# EAGLE design DC-DC (EAGLE 9.4.2)
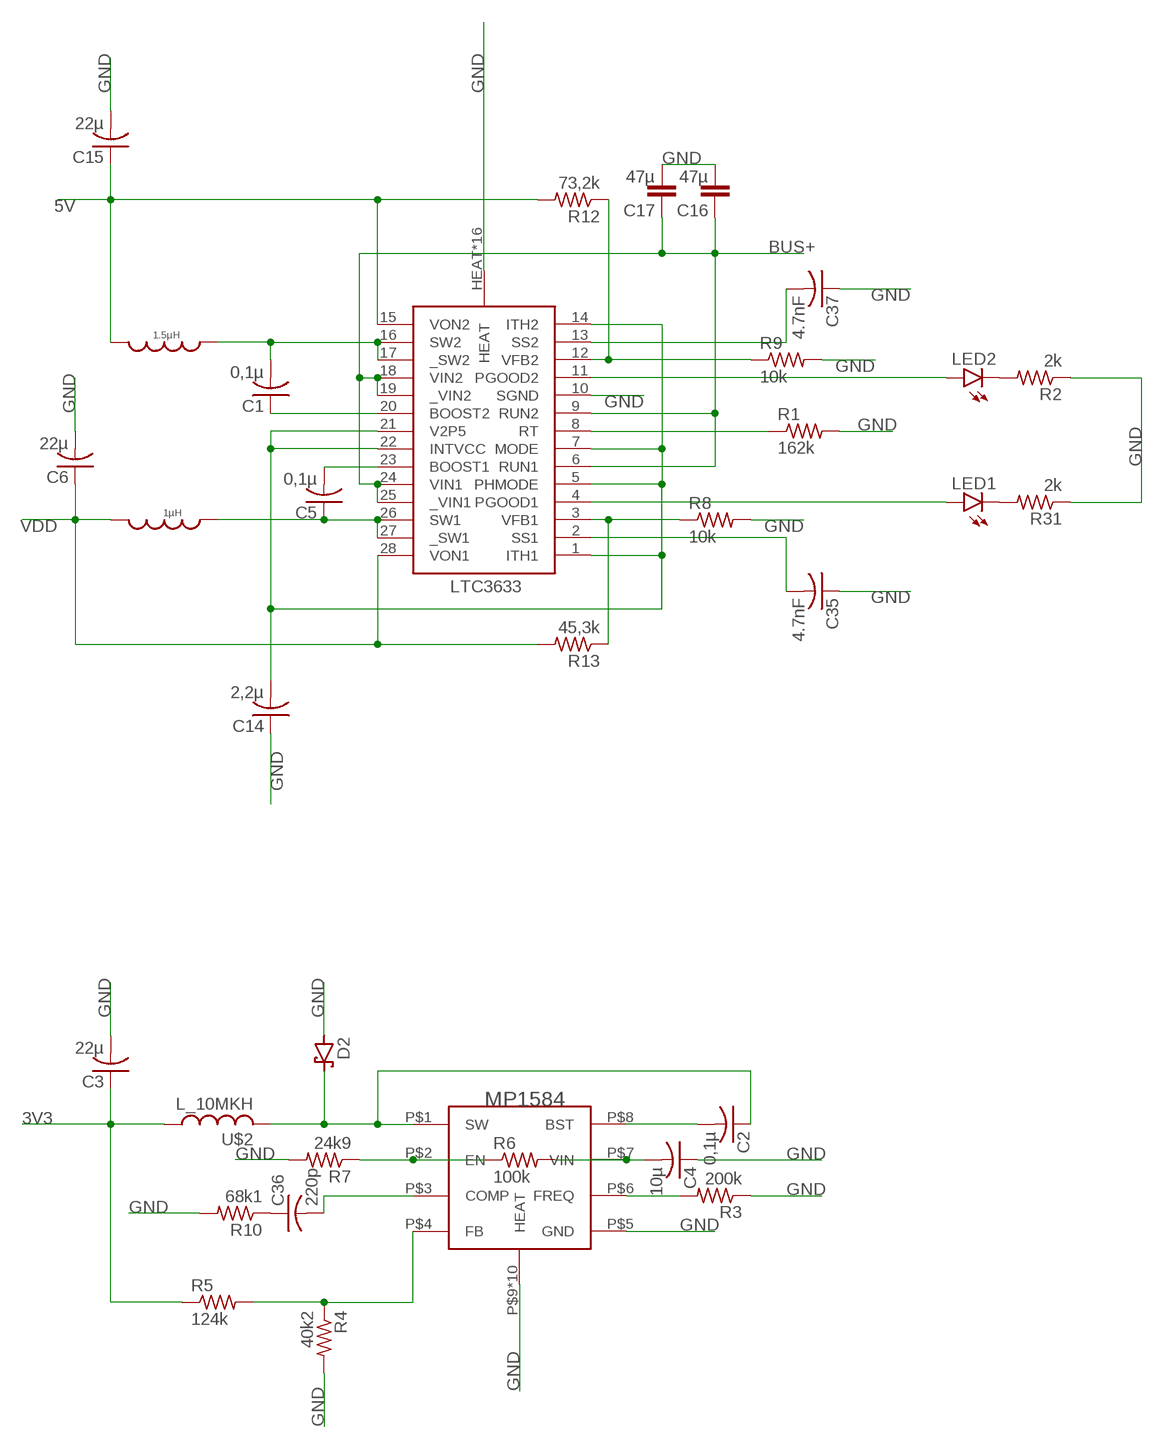
[diagram p0: schematic, sheet 1, part 1 of 3]
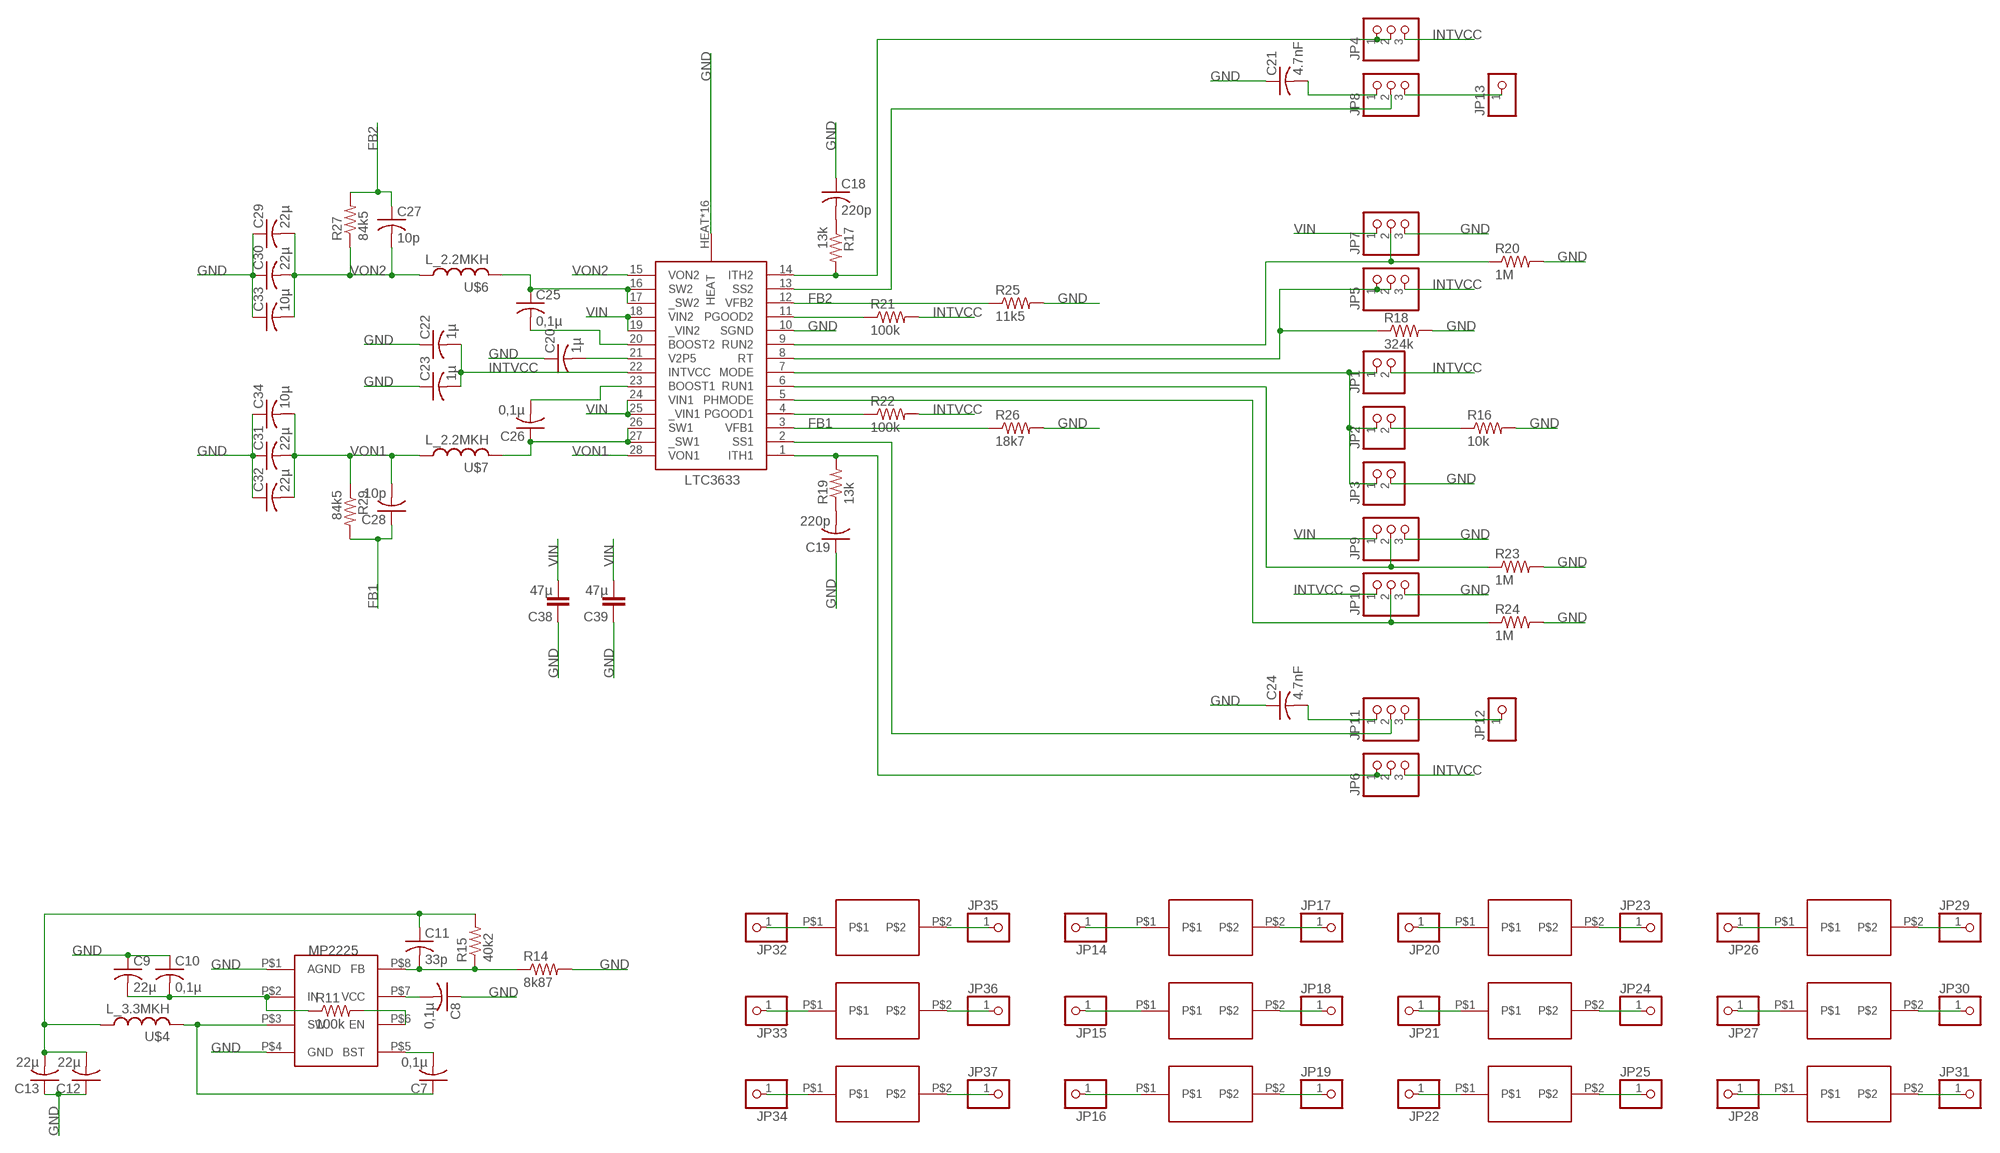
[diagram p1: schematic, sheet 1, part 2 of 3]
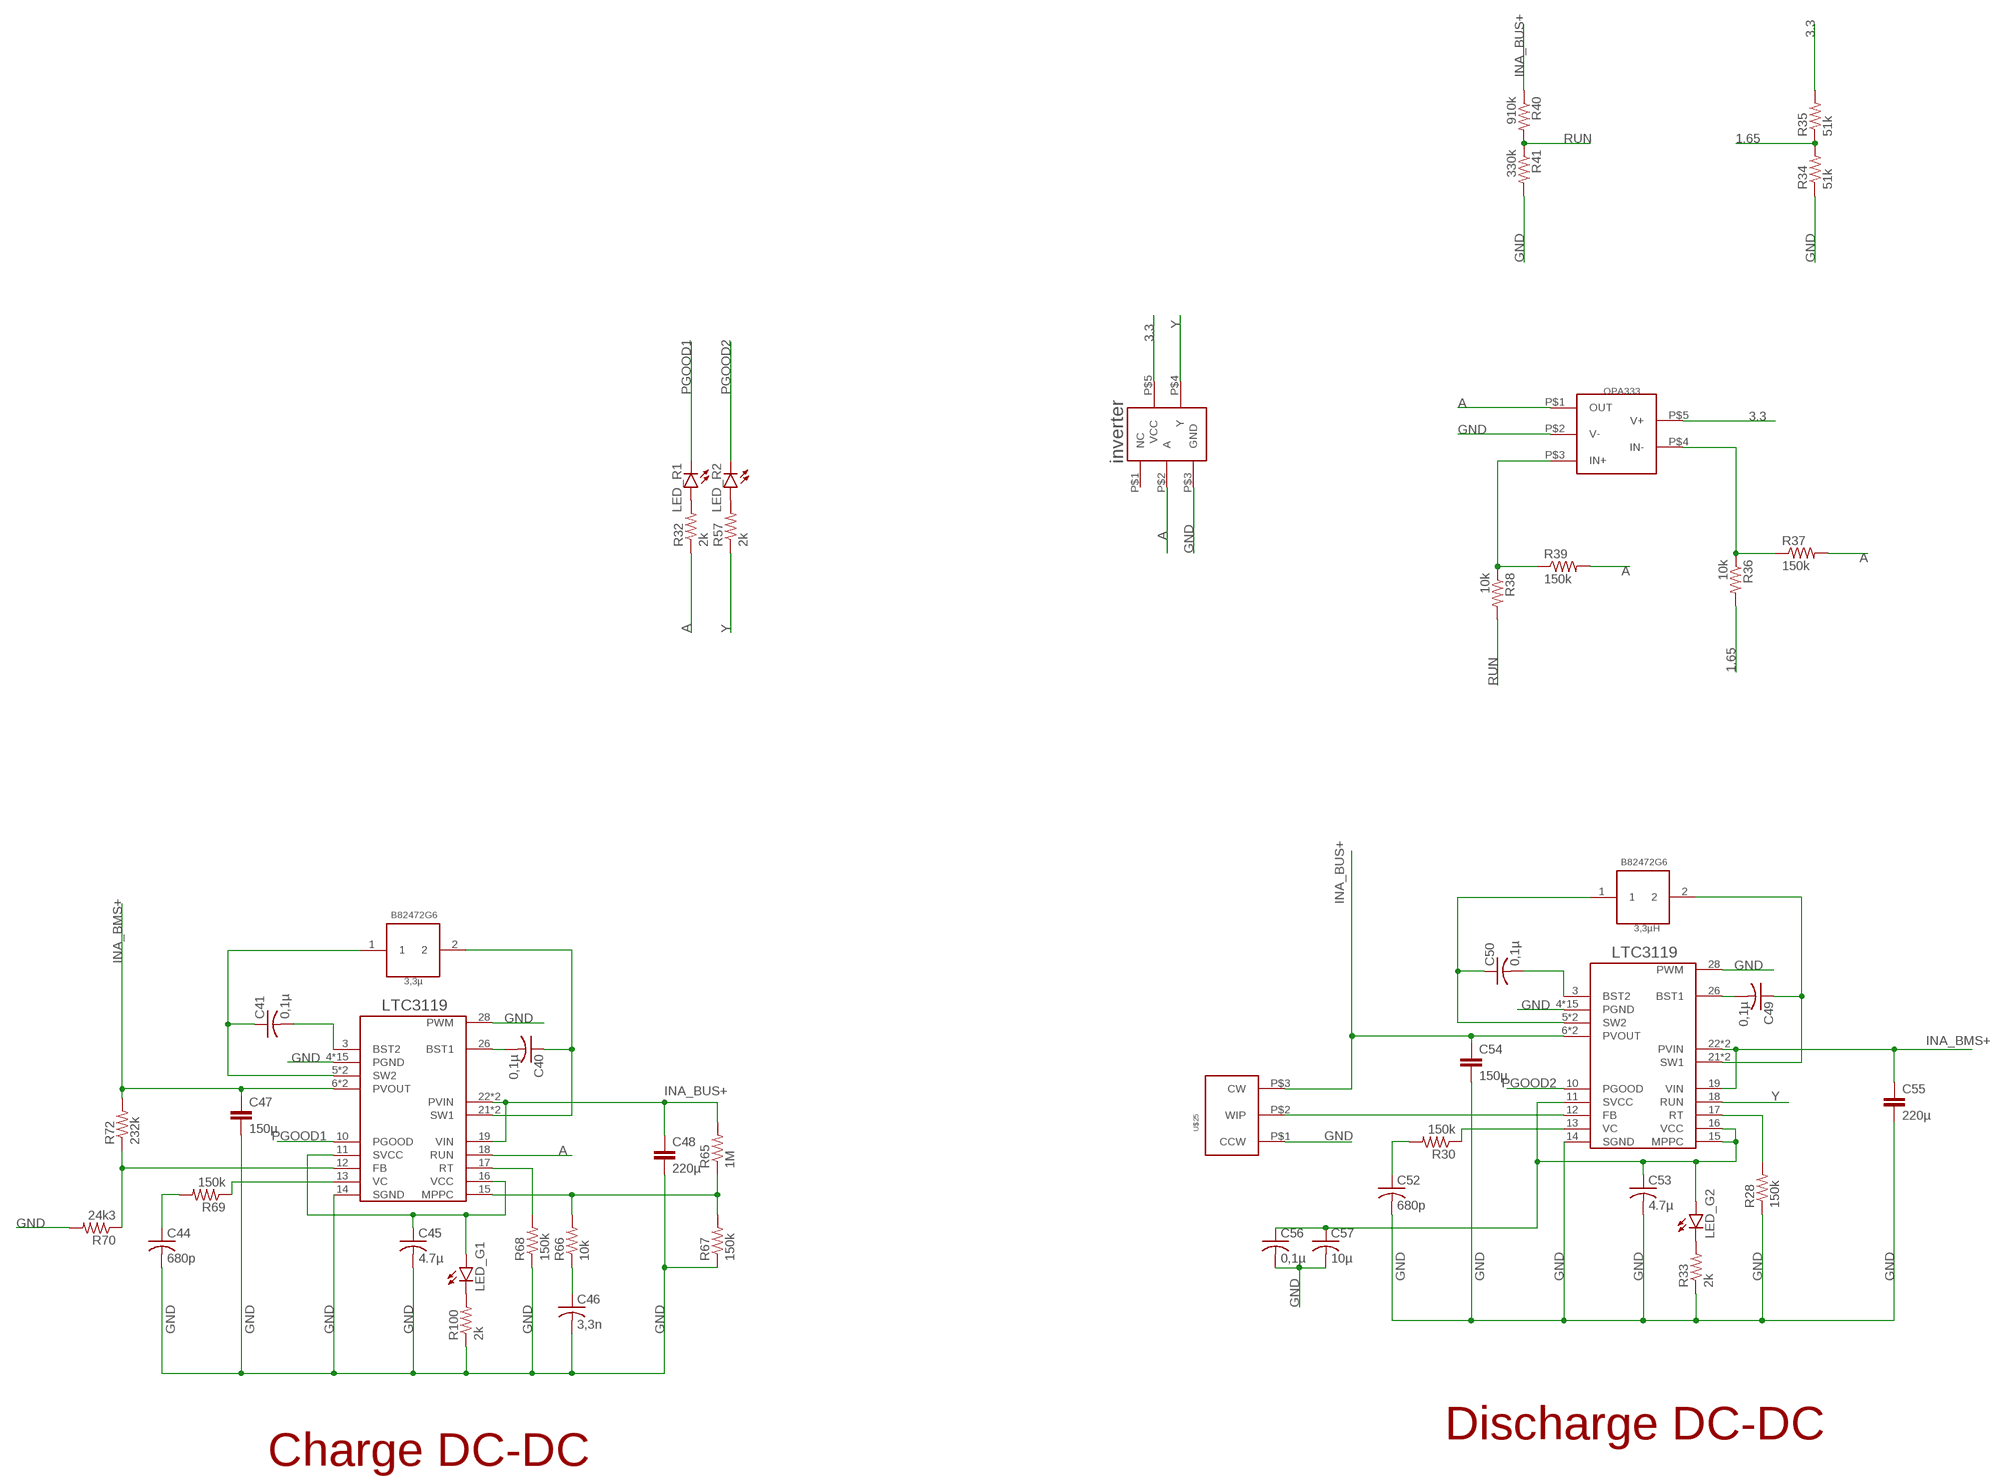
[diagram p2: schematic, sheet 1, part 3 of 3]

## Parts
3,3µH  3,3µ  B82472G6  [B82472G6]
3,3µH1  3,3µH  B82472G6  [B82472G6]
C1  0,1µ  C-USC0603  [C0603]
C2  0,1µ  C-USC0603  [C0603]
C3  22µ  C-USC1206  [C1206]
C4  10µ  C-USC1206  [C1206]
C5  0,1µ  C-USC0603  [C0603]
C6  22µ  C-USC1206  [C1206]
C7  0,1µ  C-USC0603  [C0603]
C8  0,1µ  C-USC0603  [C0603]
C9  22µ  C-USC1206  [C1206]
C10  0,1µ  C-USC0603  [C0603]
C11  33p  C-USC0603  [C0603]
C12  22µ  C-USC1206  [C1206]
C13  22µ  C-USC1206  [C1206]
C14  2,2µ  C-USC0603  [C0603]
C15  22µ  C-USC1206  [C1206]
C16  47µ  C-EUC1210  [C1210]
C17  47µ  C-EUC1210  [C1210]
C18  220p  C-USC0603  [C0603]
C19  220p  C-USC0603  [C0603]
C20  1µ  C-USC0603  [C0603]
C21  4.7nF  C-USC0603  [C0603]
C22  1µ  C-USC0603  [C0603]
C23  1µ  C-USC0603  [C0603]
C24  4.7nF  C-USC0603  [C0603]
C25  0,1µ  C-USC0603  [C0603]
C26  0,1µ  C-USC0603  [C0603]
C27  10p  C-USC0603  [C0603]
C28  10p  C-USC0603  [C0603]
C29  22µ  C-USC1206  [C1206]
C30  22µ  C-USC1206  [C1206]
C31  22µ  C-USC1206  [C1206]
C32  22µ  C-USC1206  [C1206]
C33  10µ  C-USC1206  [C1206]
C34  10µ  C-USC1206  [C1206]
C35  4.7nF  C-USC0603  [C0603]
C36  220p  C-USC0603  [C0603]
C37  4.7nF  C-USC0603  [C0603]
C38  47µ  C-EUC1210  [C1210]
C39  47µ  C-EUC1210  [C1210]
C40  0,1µ  C-USC0603  [C0603]
C41  0,1µ  C-USC0603  [C0603]
C44  680p  C-USC0603  [C0603]
C45  4.7µ  C-USC1206  [C1206]
C46  3,3n  C-USC0603  [C0603]
C47  150µ  ECAPECAP150  [ECAP150]
C48  220µ  ECAPECAP220  [ECAP220]
C49  0,1µ  C-USC0603  [C0603]
C50  0,1µ  C-USC0603  [C0603]
C52  680p  C-USC0603  [C0603]
C53  4.7µ  C-USC1206  [C1206]
C54  150µ  ECAPECAP150  [ECAP150]
C55  220µ  ECAPECAP220  [ECAP220]
C56  0,1µ  C-USC0603  [C0603]
C57  10µ  C-USC1206  [C1206]
D2  SCHOTTKY-DIODESMC  [SMC]
INVERT  INVERTER  [SOT23-5]
JP1  PINHD-1X2  [1X02]
JP2  PINHD-1X2  [1X02]
JP3  PINHD-1X2  [1X02]
JP4  PINHD-1X3  [1X03]
JP5  PINHD-1X3  [1X03]
JP6  PINHD-1X3  [1X03]
JP7  PINHD-1X3  [1X03]
JP8  PINHD-1X3  [1X03]
JP9  PINHD-1X3  [1X03]
JP10  PINHD-1X3  [1X03]
JP11  PINHD-1X3  [1X03]
JP12  PINHD-1X1  [1X01]
JP13  PINHD-1X1  [1X01]
JP14  PINHD-1X1  [1X01]
JP15  PINHD-1X1  [1X01]
JP16  PINHD-1X1  [1X01]
JP17  PINHD-1X1  [1X01]
JP18  PINHD-1X1  [1X01]
JP19  PINHD-1X1  [1X01]
JP20  PINHD-1X1  [1X01]
JP21  PINHD-1X1  [1X01]
JP22  PINHD-1X1  [1X01]
JP23  PINHD-1X1  [1X01]
JP24  PINHD-1X1  [1X01]
JP25  PINHD-1X1  [1X01]
JP26  PINHD-1X1  [1X01]
JP27  PINHD-1X1  [1X01]
JP28  PINHD-1X1  [1X01]
JP29  PINHD-1X1  [1X01]
JP30  PINHD-1X1  [1X01]
JP31  PINHD-1X1  [1X01]
JP32  PINHD-1X1  [1X01]
JP33  PINHD-1X1  [1X01]
JP34  PINHD-1X1  [1X01]
JP35  PINHD-1X1  [1X01]
JP36  PINHD-1X1  [1X01]
JP37  PINHD-1X1  [1X01]
LED1  LEDCHIPLED_0603  [CHIPLED_0603]
LED2  LEDCHIPLED_0603  [CHIPLED_0603]
LED_G1  LEDCHIPLED_0603  [CHIPLED_0603]
LED_G2  LEDCHIPLED_0603  [CHIPLED_0603]
LED_R1  LEDCHIPLED_0603  [CHIPLED_0603]
LED_R2  LEDCHIPLED_0603  [CHIPLED_0603]
OPA  OPA333  [SOT23-5]
R1  162k  R-US_R0603  [R0603]
R2  2k  R-US_R0603  [R0603]
R3  200k  R-US_R0603  [R0603]
R4  40k2  R-US_R0603  [R0603]
R5  124k  R-US_R0603  [R0603]
R6  100k  R-US_R0603  [R0603]
R7  24k9  R-US_R0603  [R0603]
R8  10k  R-US_R0603  [R0603]
R9  10k  R-US_R0603  [R0603]
R10  68k1  R-US_R0603  [R0603]
R11  100k  R-US_R0603  [R0603]
R12  73,2k  R-US_R0603  [R0603]
R13  45,3k  R-US_R0603  [R0603]
R14  8k87  R-US_R0603  [R0603]
R15  40k2  R-US_R0603  [R0603]
R16  10k  R-US_R0603  [R0603]
R17  13k  R-US_R0603  [R0603]
R18  324k  R-US_R0603  [R0603]
R19  13k  R-US_R0603  [R0603]
R20  1M  R-US_R0603  [R0603]
R21  100k  R-US_R0603  [R0603]
R22  100k  R-US_R0603  [R0603]
R23  1M  R-US_R0603  [R0603]
R24  1M  R-US_R0603  [R0603]
R25  11k5  R-US_R0603  [R0603]
R26  18k7  R-US_R0603  [R0603]
R27  84k5  R-US_R0603  [R0603]
R28  150k  R-US_R0603  [R0603]
R29  84k5  R-US_R0603  [R0603]
R30  150k  R-US_R0603  [R0603]
R31  2k  R-US_R0603  [R0603]
R32  2k  R-US_R0603  [R0603]
R33  2k  R-US_R0603  [R0603]
R34  51k  R-US_R0603  [R0603]
R35  51k  R-US_R0603  [R0603]
R36  10k  R-US_R0603  [R0603]
R37  150k  R-US_R0603  [R0603]
R38  10k  R-US_R0603  [R0603]
R39  150k  R-US_R0603  [R0603]
R40  910k  R-US_R0603  [R0603]
R41  330k  R-US_R0603  [R0603]
R57  2k  R-US_R0603  [R0603]
R65  1M  R-US_R0603  [R0603]
R66  10k  R-US_R0603  [R0603]
R67  150k  R-US_R0603  [R0603]
R68  150k  R-US_R0603  [R0603]
R69  150k  R-US_R0603  [R0603]
R70  24k3  R-US_R0603  [R0603]
R72  232k  R-US_R0603  [R0603]
R100  2k  R-US_R0603  [R0603]
U$1  MP1584+VIA  [MP1584+VIA]
U$2  L_10MKH  [L_12X12]
U$3  MP2225  [TSOT23-8]
U$4  L_3.3MKH  L_3.3MKH_5X5  [L_SPM5020]
U$5  LTC3633+VIA  [LTC3633+VIA]
U$6  L_2.2MKH  [L_SPM4020]
U$7  L_2.2MKH  [L_SPM4020]
U$8  GRAFITGRAFIT1  [GRAFIT1]
U$9  GRAFITGRAFIT1_1  [GRAFIT1_1]
U$10  LTC3633+VIA  [LTC3633+VIA]
U$11  1µH  VLS3012HBX  [VLS3012HBX]
U$12  SPM4020  [SPM4020]
U$13  GRAFITGRAFIT1_2  [GRAFIT1_2]
U$14  GRAFITGRAFIT2  [GRAFIT2]
U$15  GRAFITGRAFIT2_1  [GRAFIT2_1]
U$16  GRAFITGRAFIT2_2  [GRAFIT2_2]
U$17  GRAFITGRAFIT3  [GRAFIT3]
U$18  GRAFITGRAFIT3_1  [GRAFIT3_1]
U$19  GRAFITGRAFIT3_2  [GRAFIT3_2]
U$20  GRAFITGRAFIT4  [GRAFIT4]
U$21  GRAFITGRAFIT4_1  [GRAFIT4_1]
U$22  GRAFITGRAFIT4_2  [GRAFIT4_2]
U$23  LTC31191  [LTC3119+VIA]
U$25  32961  [3296W]
U$59  LTC31191  [LTC3119+VIA]

## Nets
1.65: R34.2 R35.1 R36.2
3.3: INVERT.P$5(VCC) OPA.P$5(V+) R35.2
3V3: C3.1 R5.1 U$2.P$1
5V: C15.1 R12.2 U$10.15(VON2) U$12.P$2
90: R65.1 R66.2 R67.2 U$59.15(MPPC)
A: INVERT.P$2(A) OPA.P$1(OUT) R32.1 R37.2 R39.2 U$59.18(RUN)
BUS+: C16.1 C17.1 U$10.6(RUN1) U$10.9(RUN2) U$10.18(VIN2) U$10.19(_VIN2) U$10.24(VIN1) U$10.25(_VIN1)
FB1: C28.1 R26.1 R29.2 U$5.3(VFB1)
FB2: C27.1 R25.1 R27.2 U$5.12(VFB2)
GND: C3.2 C4.1 C6.2 C8.1 C9.1 C10.1 C12.1 C13.1 C14.1 C15.2 C16.2 C17.2 C18.1 C19.1 C20.1 C21.1 C22.1 C23.1 C24.1 C29.1 C30.1 C31.1 C32.1 C33.1 C34.1 C35.1 C37.1 C38.1 C39.1 C44.2 C45.2 C46.2 C47.P$2 C48.P$2 C52.2 C53.2 C54.P$2 C55.P$2 C56.2 C57.2 D2.A INVERT.P$3(GND) JP3.2 JP7.3 JP9.3 JP10.3 OPA.P$2(V-) R1.2 R2.1 R3.1 R4.2 R7.2 R8.2 R9.2 R10.2 R14.2 R16.2 R18.2 R20.2 R23.2 R24.2 R25.2 R26.2 R28.1 R31.1 R33.1 R34.1 R41.2 R67.1 R68.1 R70.2 R100.1 U$1.P$5(GND) U$1.P$9(HEAT) U$1.P$10(HEAT) U$1.P$11(HEAT) U$1.P$12(HEAT) U$1.P$13(HEAT) U$1.P$14(HEAT) U$1.P$15(HEAT) U$1.P$16(HEAT) U$1.P$17(HEAT) U$1.P$18(HEAT) U$3.P$1(AGND) U$3.P$4(GND) U$5.10(SGND) U$5.HEAT U$5.P$1(HEAT) U$5.P$2(HEAT) U$5.P$3(HEAT) U$5.P$4(HEAT) U$5.P$5(HEAT) U$5.P$6(HEAT) U$5.P$7(HEAT) U$5.P$8(HEAT) U$5.P$9(HEAT) U$5.P$10(HEAT) U$5.P$11(HEAT) U$5.P$12(HEAT) U$5.P$13(HEAT) U$5.P$14(HEAT) U$5.P$15(HEAT) U$10.10(SGND) U$10.HEAT U$10.P$1(HEAT) U$10.P$2(HEAT) U$10.P$3(HEAT) U$10.P$4(HEAT) U$10.P$5(HEAT) U$10.P$6(HEAT) U$10.P$7(HEAT) U$10.P$8(HEAT) U$10.P$9(HEAT) U$10.P$10(HEAT) U$10.P$11(HEAT) U$10.P$12(HEAT) U$10.P$13(HEAT) U$10.P$14(HEAT) U$10.P$15(HEAT) U$23.4(PGND) U$23.9(PGND) U$23.14(SGND) U$23.20(PGND) U$23.25(PGND) U$23.28(PWM) U$23.29(PGND) U$23.P$1(PGND) U$23.P$2(PGND) U$23.P$3(PGND) U$23.P$4(PGND) U$23.P$5(PGND) U$23.P$6(PGND) U$23.P$7(PGND) U$23.P$8(PGND) U$23.P$9(PGND) U$23.P$10(PGND) U$25.P$1(CCW) U$59.4(PGND) U$59.9(PGND) U$59.14(SGND) U$59.20(PGND) U$59.25(PGND) U$59.28(PWM) U$59.29(PGND) U$59.P$1(PGND) U$59.P$2(PGND) U$59.P$3(PGND) U$59.P$4(PGND) U$59.P$5(PGND) U$59.P$6(PGND) U$59.P$7(PGND) U$59.P$8(PGND) U$59.P$9(PGND) U$59.P$10(PGND)
INA_BMS+: C47.P$1 C55.P$1 R72.2 U$23.19(VIN) U$23.22(PVIN) U$23.23(PVIN) U$59.6(PVOUT) U$59.7(PVOUT)
INA_BUS+: C48.P$1 C54.P$1 R40.1 R65.2 U$23.6(PVOUT) U$23.7(PVOUT) U$25.P$3(CW) U$59.19(VIN) U$59.22(PVIN) U$59.23(PVIN)
INTVCC: C22.2 C23.2 JP1.2 JP4.3 JP5.3 JP6.3 JP10.1 R21.2 R22.2 U$5.22(INTVCC)
N$1: R1.1 U$10.8(RT)
N$2: LED1.C R31.2
N$3: LED2.A U$10.11(PGOOD2)
N$4: LED2.C R2.2
N$5: C2.2 U$1.P$8(BST)
N$6: C2.1 D2.C U$1.P$1(SW) U$2.P$2
N$7: R3.2 U$1.P$6(FREQ)
N$8: R4.1 R5.2 U$1.P$4(FB)
N$9: R6.1 R7.1 U$1.P$2(EN)
N$10: C4.2 R6.2 U$1.P$7(VIN)
N$11: C36.1 R10.1
N$12: C36.2 U$1.P$3(COMP)
N$13: C7.2 U$3.P$5(BST)
N$14: C7.1 U$3.P$3(SW) U$4.P$2
N$15: R11.2 U$3.P$6(EN)
N$16: C8.2 U$3.P$7(VCC)
N$17: C9.2 C10.2 R11.1 U$3.P$2(IN)
N$18: C11.2 R14.1 R15.1 U$3.P$8(FB)
N$19: C11.1 C12.2 C13.2 R15.2 U$4.P$1
N$20: JP1.1 JP2.1 JP3.1 U$5.7(MODE)
N$21: JP4.1 JP4.2 R17.2 U$5.14(ITH2)
N$22: C18.2 R17.1
N$23: JP2.2 R16.1
N$24: C14.2 U$10.1(ITH1) U$10.5(PHMODE) U$10.7(MODE) U$10.14(ITH2) U$10.21(V2P5) U$10.22(INTVCC)
N$25: R8.1 R13.1 U$10.3(VFB1)
N$26: JP5.1 JP5.2 R18.1 U$5.8(RT)
N$27: C20.2 U$5.21(V2P5)
N$28: C5.1 U$10.26(SW1) U$10.27(_SW1) U$11.P$1
N$29: JP6.1 JP6.2 R19.2 U$5.1(ITH1)
N$30: C19.2 R19.1
N$31: C5.2 U$10.23(BOOST1)
N$32: C1.1 U$10.20(BOOST2)
N$33: C1.2 U$10.16(SW2) U$10.17(_SW2) U$12.P$1
N$34: C25.1 U$5.16(SW2) U$5.17(_SW2) U$6.P$2
N$35: C26.1 U$5.26(SW1) U$5.27(_SW1) U$7.P$2
N$36: R22.1 U$5.4(PGOOD1)
N$37: JP8.2 U$5.13(SS2)
N$38: JP7.2 R20.1 U$5.9(RUN2)
N$39: R9.1 R12.1 U$10.12(VFB2)
N$40: R21.1 U$5.11(PGOOD2)
N$41: JP9.2 R23.1 U$5.6(RUN1)
N$42: JP11.2 U$5.2(SS1)
N$43: C21.2 JP8.1
N$44: JP10.2 R24.1 U$5.5(PHMODE)
N$45: C24.2 JP11.1
N$46: C25.2 U$5.20(BOOST2)
N$47: LED1.A U$10.4(PGOOD1)
N$48: C26.2 U$5.23(BOOST1)
N$49: JP8.3 JP13.1
N$50: JP11.3 JP12.1
N$51: C35.2 U$10.2(SS1)
N$52: C37.2 U$10.13(SS2)
N$53: JP14.1 U$14.P$1
N$54: JP15.1 U$15.P$1
N$55: JP16.1 U$16.P$1
N$56: JP17.1 U$14.P$2
N$57: JP18.1 U$15.P$2
N$58: JP19.1 U$16.P$2
N$59: JP20.1 U$17.P$1
N$60: JP21.1 U$18.P$1
N$61: JP22.1 U$19.P$1
N$62: JP23.1 U$17.P$2
N$63: JP24.1 U$18.P$2
N$64: JP25.1 U$19.P$2
N$65: JP26.1 U$20.P$1
N$66: JP27.1 U$21.P$1
N$67: JP28.1 U$22.P$1
N$68: JP29.1 U$20.P$2
N$69: JP30.1 U$21.P$2
N$70: JP31.1 U$22.P$2
N$71: JP32.1 U$8.P$1
N$72: JP33.1 U$9.P$1
N$73: JP34.1 U$13.P$1
N$74: JP35.1 U$8.P$2
N$75: JP36.1 U$9.P$2
N$76: JP37.1 U$13.P$2
N$77: 3,3µH1.2 C49.1 U$23.21(SW1) U$23.24(SW1)
N$78: 3,3µH1.1 C50.1 U$23.5(SW2) U$23.8(SW2)
N$79: R28.2 U$23.17(RT)
N$80: C49.2 U$23.26(BST1)
N$81: R30.1 U$23.13(VC)
N$82: C52.1 R30.2
N$84: C50.2 U$23.3(BST2)
N$85: LED_R1.A R32.2
N$86: U$23.12(FB) U$25.P$2(WIP)
N$87: LED_R2.A R57.2
N$89: R70.1 R72.1 U$59.12(FB)
N$90: OPA.P$3(IN+) R38.1 R39.1
N$91: LED_G1.C R100.2
N$92: LED_G2.C R33.2
N$129: C41.2 U$59.3(BST2)
N$131: 3,3µH.2 C40.1 U$59.21(SW1) U$59.24(SW1)
N$132: 3,3µH.1 C41.1 U$59.5(SW2) U$59.8(SW2)
N$135: R69.1 U$59.13(VC)
N$136: C44.1 R69.2
N$139: C46.1 R66.1
N$142: R68.2 U$59.17(RT)
N$144: C40.2 U$59.26(BST1)
N$215: C53.1 C56.1 C57.1 LED_G2.A U$23.11(SVCC) U$23.15(MPPC) U$23.16(VCC)
N$234: C45.1 LED_G1.A U$59.11(SVCC) U$59.16(VCC)
N$302: OPA.P$4(IN-) R36.1 R37.1
PGOOD1: LED_R1.C U$59.10(PGOOD)
PGOOD2: LED_R2.C U$23.10(PGOOD)
RUN: R38.2 R40.2 R41.1
VDD: C6.1 R13.2 U$10.28(VON1) U$11.P$2
VIN: C38.2 C39.2 JP7.1 JP9.1 U$5.18(VIN2) U$5.19(_VIN2) U$5.24(VIN1) U$5.25(_VIN1)
VON1: C28.2 C31.2 C32.2 C34.2 R29.1 U$5.28(VON1) U$7.P$1
VON2: C27.2 C29.2 C30.2 C33.2 R27.1 U$5.15(VON2) U$6.P$1
Y: INVERT.P$4(Y) R57.1 U$23.18(RUN)
Unconnected: INVERT.P$1(NC)

## Notes on the sheet
- 1.5µH
- 1µH
- Discharge DC-DC
- Charge DC-DC

## Library data of the parts
3,3µH 3,3µH1 = CanCubeSat:B82472G6
C1-C15 C18-C37 C40 C41 C44-C46 C49 C50 C52 C53 C56 C57 = rcl:C-US: CAPACITOR, American symbol; SPICEPREFIX: C
C16 C17 C38 C39 = rcl:C-EU: CAPACITOR, European symbol; SPICEPREFIX: C
C47 C48 C54 C55 = CanCubeSat:ECAP
D2 = diode:SCHOTTKY-DIODE: Schottky Diode
INVERT = CanCubeSat:INVERTER
JP1-JP3 = pinheadCS:PINHD-1X2: PIN HEADER
JP4-JP11 = pinheadCS:PINHD-1X3: PIN HEADER
JP12-JP37 = pinheadCS:PINHD-1X1: PIN HEADER
LED1 LED2 LED_G1 LED_G2 LED_R1 LED_R2 = led:LED: LED OSRAM: - CHIPLED LG R971, LG N971, LY N971, LG Q971, LY Q971, LO R971, LY R971 LH N974, LH R974 LS Q976, LO Q976, LY Q976 LO Q996 - Hyper CHIPLED LW Q18S LB Q993, LB Q99A, LB R99A - SideLED LS A670, LO A670, LY A670, LG A670, LP A670 LB A673, LV A673, LT A673, LW A673 LH A674 LY A675 LS A676, LA A676, LO A676, LY A676, LW A676 LS A679, LY A679, LG A679 - Hyper Micro SIDELED® LS Y876, LA Y876, LO Y876, LY Y876 LT Y87S - SmartLED LW L88C, LW L88S LB L89C, LB L89S, LG L890 LS L89K, LO L89K, LY L89K LS L896, LA L896, LO L896, LY L896 - TOPLED LS T670, LO T670, LY T670, LG T670, LP T670 LSG T670, LSP T670, LSY T670, LOP T670, LYG T670 LG T671, LOG T671, LSG T671 LB T673, LV T673, LT T673, LW T673 LH T674 LS T676, LA T676, LO T676, LY T676, LB T676, LH T676, LSB T676, LW T676 LB T67C, LV T67C, LT T67C, LS T67K, LO T67K, LY T67K, LW E67C LS E67B, LA E67B, LO E67B, LY E67B, LB E67C, LV E67C, LT E67C LW T67C LS T679, LY T679, LG T679 LS T770, LO T770, LY T770, LG T770, LP T770 LB T773, LV T773, LT T773, LW T773 LH T774 LS E675, LA E675, LY E675, LS T675 LS T776, LA T776, LO T776, LY T776, LB T776 LHGB T686 LT T68C, LB T68C - Hyper Mini TOPLED® LB M676 - Mini TOPLED Santana® LG M470 LS M47K, LO M47K, LY M47K Source: http://www.osram.convergy.de LUXEON: - LUMILED® LXK2-PW12-R00, LXK2-PW12-S00, LXK2-PW14-U00, LXK2-PW14-V00 LXK2-PM12-R00, LXK2-PM12-S00, LXK2-PM14-U00 LXK2-PE12-Q00, LXK2-PE12-R00, LXK2-PE12-S00, LXK2-PE14-T00, LXK2-PE14-U00 LXK2-PB12-K00, LXK2-PB12-L00, LXK2-PB12-M00, LXK2-PB14-N00, LXK2-PB14-P00, LXK2-PB14-Q00 LXK2-PR12-L00, LXK2-PR12-M00, LXK2-PR14-Q00, LXK2-PR14-R00 LXK2-PD12-Q00, LXK2-PD12-R00, LXK2-PD12-S00 LXK2-PH12-R00, LXK2-PH12-S00 LXK2-PL12-P00, LXK2-PL12-Q00, LXK2-PL12-R00 Source: www.luxeon.com KINGBRIGHT: KA-3528ASYC Source: www.kingbright.com
OPA = CanCubeSat:OPA333
R1-R41 R57 R65-R70 R72 R100 = resistor:R-US_: RESISTOR, American symbol
U$1 = CanCubeSat:MP1584+VIA
U$2 = CanCubeSat:L_10MKH
U$3 = CanCubeSat:MP2225
U$4 = CanCubeSat:L_3.3MKH_5X5
U$5 U$10 = CanCubeSat:LTC3633+VIA
U$6 U$7 = CanCubeSat:L_2.2MKH
U$8 U$9 U$13-U$22 = CanCubeSat:GRAFIT
U$11 = CanCubeSat:VLS3012HBX
U$12 = CanCubeSat:SPM4020
U$23 U$59 = CanCubeSat:LTC3119
U$25 = CanCubeSat:3296

## Board
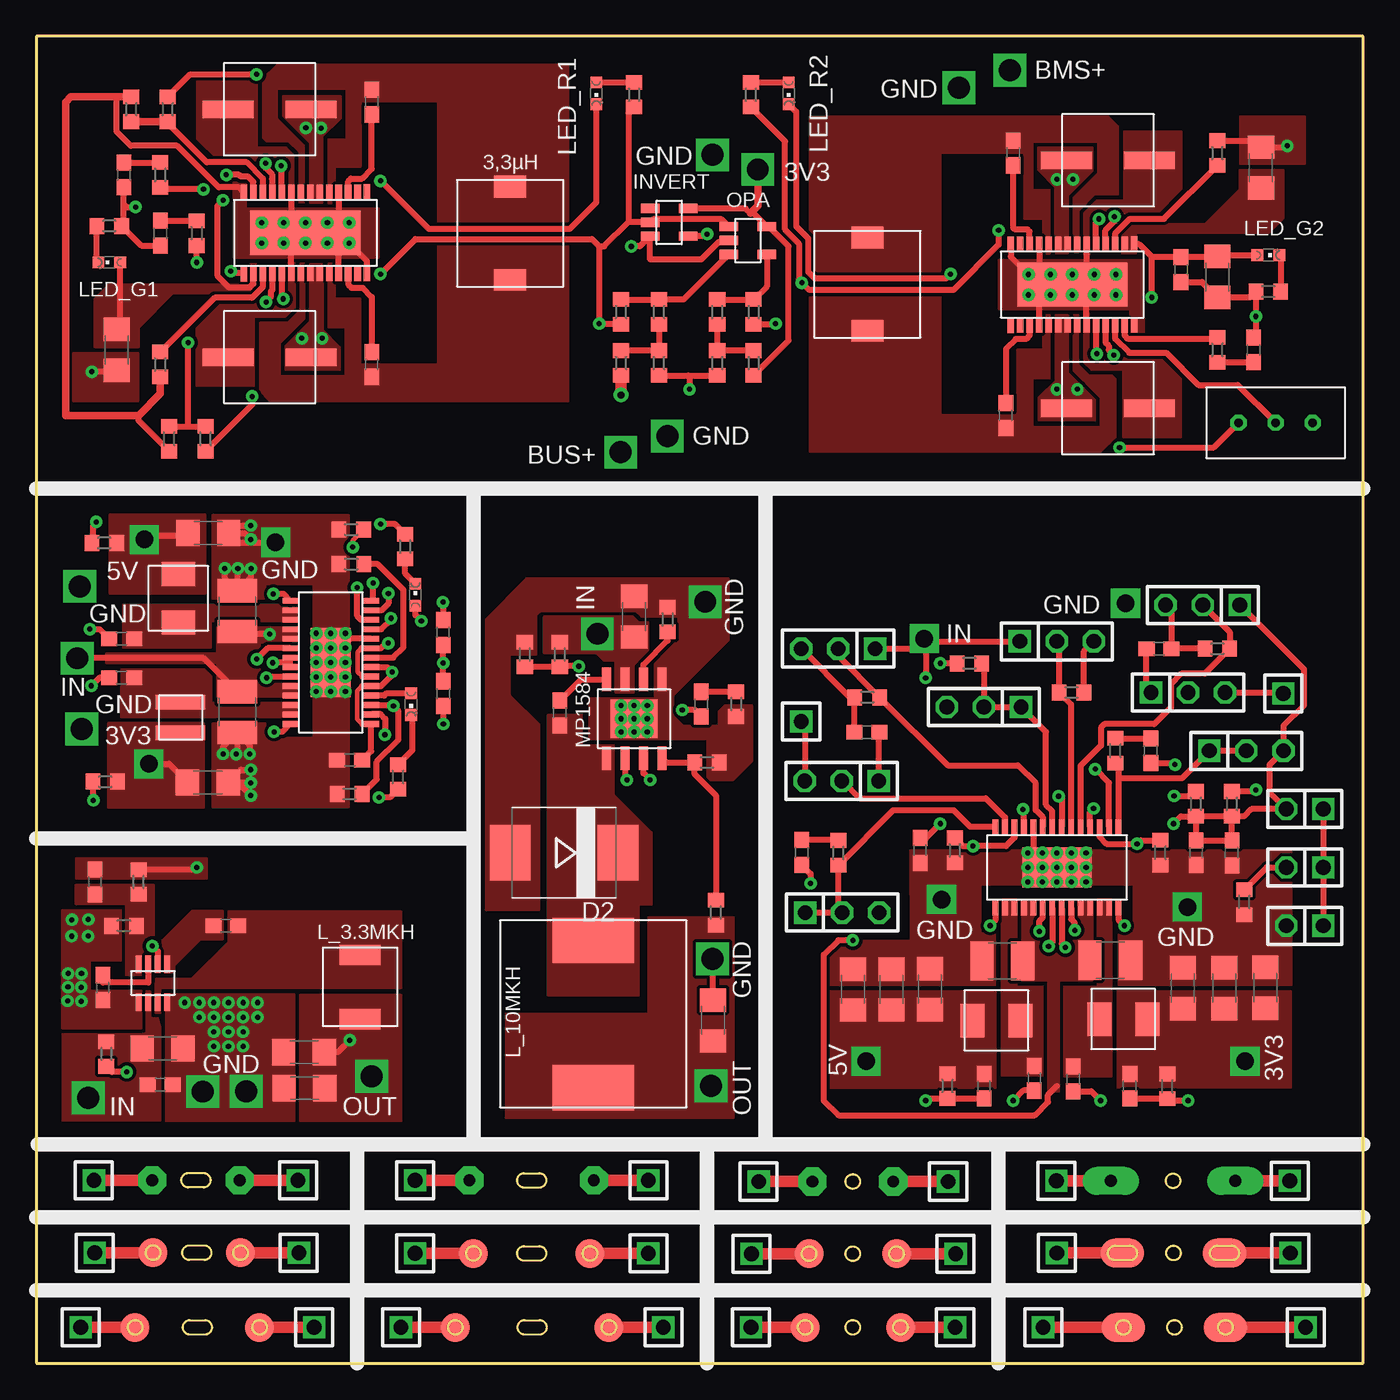
[diagram p3: board, top side]
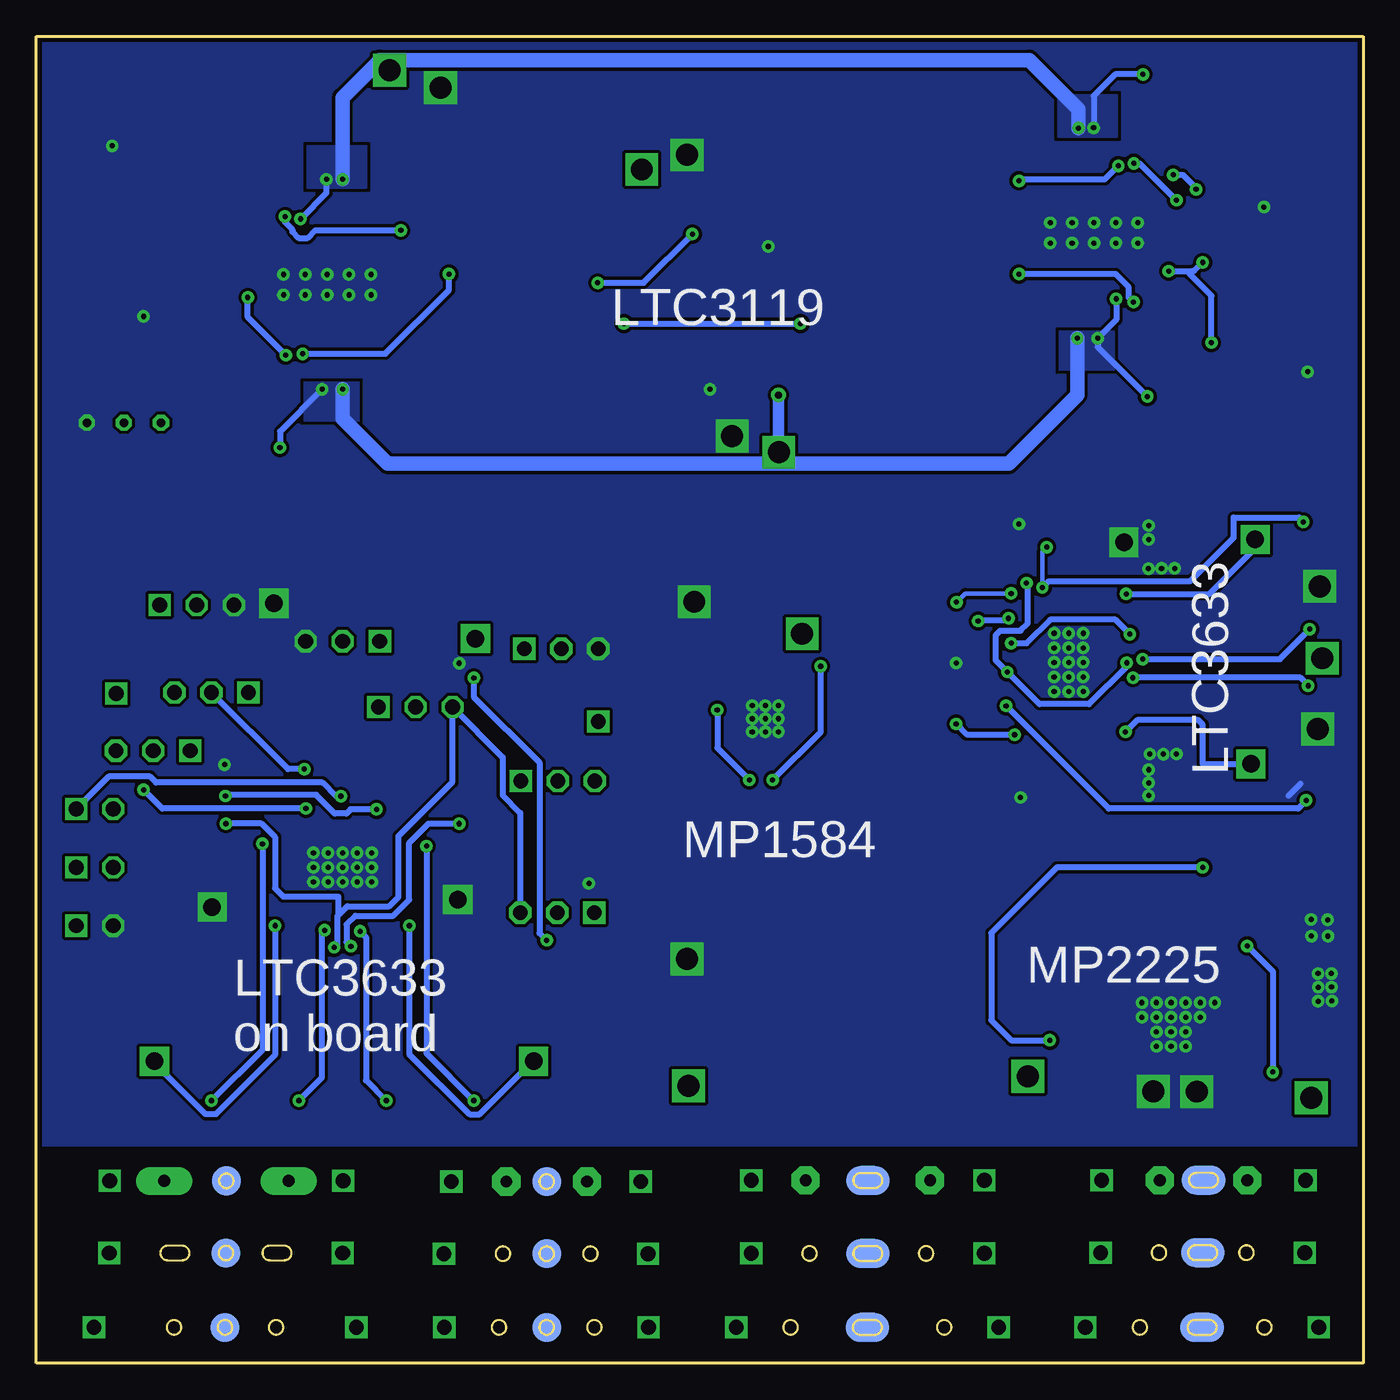
[diagram p4: board, bottom side, seen from below]

Size 91 x 91 mm. Coordinates in mm from the lower left corner, seen from the top.
Outline: 0,0 91,0 91,91 0,91 0,0
Copper layers (1*16): Top 0.035mm / dielectric 1.5mm / Bottom 0.035mm
Design rules "default *": minimum track width 0.3mm, minimum drill 0.35mm, track to track 0.22mm, track to pad 0.22mm, pad to pad 0.2mm, via to via 0.22mm, smd to smd 0.22mm, copper to edge 0.3mm, drill to drill 0.3mm, minimum pad ring 0.25mm, minimum via ring 0.25mm, stop-mask expansion 4mil, vias tented up to drill 0mil, thermal gap 10mil

### Footprints (pad centres in the part's own frame; a part is rotated, then mirrored left to right if it is on the bottom)
B82472G6 = smd 1.5 x 2.2: 1 -3.2,0; 2 3.2,0
C0603 = smd 1.1 x 1: 1 -0.85,0; 2 0.85,0
C1206 = smd 1.6 x 1.8: 1 -1.4,0; 2 1.4,0
C1210 = smd 1.6 x 2.7: 1 -1.4,0; 2 1.4,0
ECAP150 = smd 1.2 x 3.5: P$1 0,2.85; P$2 0,-2.85
ECAP220 = smd 1.2 x 3.5: P$1 0,2.85; P$2 0,-2.85
SMC = smd 2.8 x 3.8: A 3.7,0; C -3.7,0
SOT23-5 = smd 0.635 x 1.27: P$1 -0.95,-1.3; P$2 0,-1.3; P$3 0.95,-1.3; P$4 0.95,1.3; P$5 -0.95,1.3
1X02 = drill 1.016 square: 1 -1.27,0 | drill 1.016 octagon: 2 1.27,0
1X03 = drill 1.016 square: 1 -2.54,0 | drill 1.016 octagon: 2 0,0; 3 2.54,0
1X01 = drill 1.016 square: 1 0,0
CHIPLED_0603 = smd 0.8 x 0.8: A 0,-0.75; C 0,0.75
R0603 = smd 1 x 1.1: 1 -0.85,0; 2 0.85,0
MP1584+VIA = smd 0.61 x 1.6: P$1 -1.905,-2.7; P$2 -0.635,-2.7; P$3 0.635,-2.7; P$4 1.905,-2.7; P$5 1.905,2.7; P$6 0.635,2.7; P$7 -0.635,2.7; P$8 -1.905,2.7 | smd 3.21 x 2.62: P$9 0,0 | drill 0.35: P$10 -0.9,0.9; P$11 0,0.9; P$12 0.9,0.9; P$13 -0.9,0; P$14 0,0; P$15 0.9,0; P$16 -0.9,-0.9; P$17 0,-0.9; P$18 0.9,-0.9
L_12X12 = smd 3.1 x 5.6: P$1 -5.05,0; P$2 5.05,0
TSOT23-8 = smd 0.4 x 1.2: P$1 -0.975,-1.3; P$2 -0.325,-1.3; P$3 0.325,-1.3; P$4 0.975,-1.3; P$5 0.975,1.3; P$6 0.325,1.3; P$7 -0.325,1.3; P$8 -0.975,1.3
L_SPM5020 = smd 1.4 x 2.8: P$1 -2.2,0; P$2 2.2,0
LTC3633+VIA = smd 0.4 x 1.05: 1 -4.225,-2.775; 2 -3.575,-2.775; 3 -2.925,-2.775; 4 -2.275,-2.775; 5 -1.625,-2.775; 6 -0.975,-2.775; 7 -0.325,-2.775; 8 0.325,-2.775; 9 0.975,-2.775; 10 1.625,-2.775; 11 2.275,-2.775; 12 2.925,-2.775; 13 3.575,-2.775; 14 4.225,-2.775; 15 4.225,2.775; 16 3.575,2.775; 17 2.925,2.775; 18 2.275,2.775; 19 1.625,2.775; 20 0.975,2.775; 21 0.325,2.775; 22 -0.325,2.775; 23 -0.975,2.775; 24 -1.625,2.775; 25 -2.275,2.775; 26 -2.925,2.775; 27 -3.575,2.775; 28 -4.225,2.775 | smd 4.75 x 2.74: HEAT 0,0 | drill 0.35 pad 0.813: P$1 -2,1; P$2 -1,1; P$3 0,1; P$4 1,1; P$5 2,1; P$6 2,0; P$7 1,0; P$8 0,0; P$9 -1,0; P$10 -2,0; P$11 -2,-1; P$12 -1,-1; P$13 0,-1; P$14 1,-1; P$15 2,-1
L_SPM4020 = smd 1.65 x 2.3: P$1 -1.65,0; P$2 1.65,0
GRAFIT1 = smd 2 x 3 bottom: OUT 0,0 | drill 0.8 pad 1.93 octagon: P$1 0,-3; P$2 0,3
GRAFIT1_1 = smd 2 x 3 bottom: OUT 0,0 | smd 2 x 2: P$1 0,3; P$2 0,-3
VLS3012HBX = smd 1 x 3.4: P$1 -1.05,0; P$2 1.05,0
SPM4020 = smd 1.65 x 2.3: P$1 -1.65,0; P$2 1.65,0
GRAFIT1_2 = smd 2 x 3 bottom: OUT 0,0 | smd 2 x 2: P$1 0,4.27; P$2 0,-4.27
GRAFIT2 = smd 2 x 3 bottom: OUT 0,0 | drill 0.8 pad 1.93 octagon: P$1 0,-4.27; P$2 0,4.27
GRAFIT2_1 = smd 2 x 3 bottom: OUT 0,0 | smd 2 x 2: P$1 0,4; P$2 0,-4
GRAFIT2_2 = smd 2 x 3 bottom: OUT 0,0 | smd 2 x 2: P$1 0,5.27; P$2 0,-5.27
GRAFIT3 = smd 2 x 2 bottom: OUT 0,0 | drill 0.8 pad 1.93 octagon: P$1 0,-2.77; P$2 0,2.77
GRAFIT3_1 = smd 2 x 2 bottom: OUT 0,0 | smd 2 x 2: P$1 0,3; P$2 0,-3
GRAFIT3_2 = smd 2 x 2 bottom: OUT 0,0 | smd 2 x 2: P$1 0,3.27; P$2 0,-3.27
GRAFIT4 = smd 2 x 2 bottom: OUT 0,0 | drill 0.8 pad 1.93 long: P$1 0,-4.27; P$2 0,4.27
GRAFIT4_1 = smd 2 x 2 bottom: OUT 0,0 | smd 2 x 3: P$1 0,3.5; P$2 0,-3.5
GRAFIT4_2 = smd 2 x 2 bottom: OUT 0,0 | smd 2 x 3: P$1 0,3.5; P$2 0,-3.5
LTC3119+VIA = smd 0.45 x 1.05: 1 -4.225,-2.775; 2 -3.575,-2.775; 3 -2.925,-2.775; 4 -2.275,-2.775; 5 -1.625,-2.775; 6 -0.975,-2.775; 7 -0.325,-2.775; 8 0.325,-2.775; 9 0.975,-2.775; 10 1.625,-2.775; 11 2.275,-2.775; 12 2.925,-2.775; 13 3.575,-2.775; 14 4.225,-2.775; 15 4.225,2.775; 16 3.575,2.775; 17 2.925,2.775; 18 2.275,2.775; 19 1.625,2.775; 20 0.975,2.775; 21 0.325,2.775; 22 -0.325,2.775; 23 -0.975,2.775; 24 -1.625,2.775; 25 -2.275,2.775; 26 -2.925,2.775; 27 -3.575,2.775; 28 -4.225,2.775 | smd 7.56 x 3.05: 29 0,0 | drill 0.35 pad 0.813: P$1 -3,0.7; P$2 -1.5,0.7; P$3 0,0.7; P$4 1.5,0.7; P$5 3,0.7; P$6 3,-0.7; P$7 1.5,-0.7; P$8 0,-0.7; P$9 -1.5,-0.7; P$10 -3,-0.7
3296W = drill 0.6 octagon: P$1 -2.54,0; P$2 0,0; P$3 2.54,0

### Placement (x,y rotation side)
3,3µH  32.5,77.5 270 top
3,3µH1  57,74 90 top
C1  5.84,49.68 0 top
C2  35.9,44.6 90 top
C3  46.4,23.5 90 top
C4  41,51.2 270 top
C5  5.84,47.02 180 top
C6  11.76,39.83 0 top
C7  13,30 180 top
C8  4.55,25.76 90 top
C9  8.65,21.58 180 top
C10  8.49,19.11 180 top
C11  4,33 270 top
C12  18.36,21.33 0 top
C13  18.39,18.86 0 top
C14  21.49,41.36 0 top
C15  11.78,56.93 0 top
C16  13.78,44.65 270 top
C17  13.79,51.58 90 top
C18  52.49,35.02 90 top
C19  76.44,42 90 top
C20  60.61,35.17 90 top
C21  56.97,43.26 0 top
C22  79.54,35.01 90 top
C23  82,35 90 top
C24  77,49 180 top
C25  68.45,19.54 270 top
C26  71.11,19.49 270 top
C27  65,19 90 top
C28  75,19 90 top
C29  61.29,25.65 270 top
C30  58.65,25.63 270 top
C31  78.64,25.72 270 top
C32  81.48,25.72 270 top
C33  56.01,25.63 270 top
C34  84.3,25.75 270 top
C35  27.9,45.92 270 top
C36  45.6,45.2 270 top
C37  27.9,50.12 90 top
C38  73.66,27.64 180 top
C39  66.25,27.59 0 top
C40  23,68.5 90 top
C41  23,86.5 270 top
C44  6,81.5 270 top
C45  5.5,69.5 270 top
C46  8.5,77.5 270 top
C47  16,86 270 top
C48  16,69 270 top
C49  67,83 270 top
C50  66.5,65 90 top
C52  83.5,69.5 90 top
C53  84,82 90 top
C54  73.5,65.5 90 top
C55  73.5,82.5 90 top
C56  78.5,75 270 top
C57  81,74.5 270 top
D2  36.2,35 180 top
INVERT  43.4,78.25 270 top
JP1  87,38 180 top
JP2  87,34 180 top
JP3  87,30 180 top
JP4  55.27,30.9 0 top
JP5  65,45 180 top
JP6  83,42 0 top
JP7  55,49 180 top
JP8  55.24,39.93 180 top
JP9  69.99,49.51 0 top
JP10  80,52 180 top
JP11  79,46 0 top
JP12  85.52,45.92 270 top
JP13  52.46,44 270 top
JP14  41.97,12.53 0 top
JP15  25.97,7.52 0 top
JP16  25,2.45 0 top
JP17  25.97,12.53 0 top
JP18  41.97,7.52 0 top
JP19  43,2.45 0 top
JP20  62.54,12.45 0 top
JP21  49.05,7.5 0 top
JP22  49.02,2.45 0 top
JP23  49.54,12.45 0 top
JP24  63.05,7.5 0 top
JP25  63.02,2.45 0 top
JP26  85.97,12.5 0 top
JP27  70,7.55 0 top
JP28  69.06,2.45 0 top
JP29  69.97,12.5 0 top
JP30  86,7.55 0 top
JP31  87.06,2.45 0 top
JP32  17.94,12.54 0 top
JP33  4,7.57 0 top
JP34  3.04,2.45 0 top
JP35  3.94,12.54 0 top
JP36  18,7.57 0 top
JP37  19.04,2.45 0 top
LED1  25.7,45.2 180 top
LED2  26,52.7 0 top
LED_G1  5,75.5 90 top
LED_G2  84.5,76 270 top
LED_R1  38.4,87.1 180 top
LED_R2  51.6,87.1 180 top
OPA  48.8,77 270 top
R1  21.6,54.8 180 top
R2  25.3,56.01 270 top
R3  43.3,51 270 top
R4  46,41.2 0 top
R5  46.6,30.9 90 top
R6  35.9,48.6 90 top
R7  33.5,48.6 90 top
R8  21.49,39.04 180 top
R9  21.59,57.17 180 top
R10  48,45.2 270 top
R11  4.8,21.2 270 top
R12  4.66,56.26 0 top
R13  4.72,39.88 0 top
R14  6,30 180 top
R15  7,33 90 top
R16  82.85,31.62 270 top
R17  55,35 270 top
R18  64,48 180 top
R19  74,42 270 top
R20  56.99,45.67 180 top
R21  79.53,38.36 270 top
R22  82,38.36 270 top
R23  71,46 0 top
R24  81,49 180 top
R25  63,35.17 270 top
R26  77.09,35.01 270 top
R27  62.49,19.01 270 top
R28  81,83 270 top
R29  77.57,18.99 270 top
R30  81,69.5 270 top
R31  24.8,40.2 90 top
R32  41,87 90 top
R33  84.5,73.5 0 top
R34  46.7,68.6 90 top
R35  49.2,68.6 270 top
R36  46.7,72.1 270 top
R37  49.2,72.1 270 top
R38  42.7,72.1 270 top
R39  40.1,72.1 270 top
R40  40.1,68.6 90 top
R41  42.7,68.6 270 top
R57  49,87 90 top
R65  11.6,63.4 270 top
R66  11,77.5 270 top
R67  9.1,63.4 90 top
R68  8.5,68.5 90 top
R69  8.5,81.5 90 top
R70  6.5,86 90 top
R72  9,86 90 top
R100  5,78 180 top
U$1  41,44.2 0 top
U$2  38.2,23.95 90 top
U$3  8,26.07 0 top
U$4  22.2,25.8 90 top
U$5  70,34 180 top
U$6  65.85,23.5 0 top
U$7  74.55,23.6 180 top
U$8  10.94,12.54 90 top
U$9  11,7.57 90 top
U$10  20.19,48.06 90 top
U$11  9.89,44.28 270 top
U$12  9.73,52.46 90 top
U$13  11.04,2.45 90 top
U$14  33.97,12.53 90 top
U$15  33.97,7.52 90 top
U$16  34,2.45 90 top
U$17  56,12.45 90 top
U$18  56,7.5 90 top
U$19  56,2.45 90 top
U$20  77.97,12.5 90 top
U$21  78,7.55 90 top
U$22  78.06,2.45 90 top
U$23  71.06,73.97 0 top
U$25  85,64.5 180 top
U$59  18.45,77.53 180 top

### Tracks (layer width: path | path; a pad name or v marks a point on that pad's centre or on a via)
1.65
  Top 0.4: R35.1 R34.2 R36.2
3.3  (via drill 1.5)
  Top 0.4: 49.08,78.97 OPA.P$5 50.25,77.95 51.6,76.6 51.6,70.15 R35.2 | 48.98,78.88 48.65,79.2 INVERT.P$5
  Top 0.5: v49.48,81.88 49.48,79.38 49.08,78.97 48.98,78.88
3V3  (via drill 1.5)
  other vias: 46.28,19.02
  pour Top (no thermals): 32.2,16.8 32.2,24 42,24 42,30.6 47.8,30.6 47.8,16.8
5V  (via drill 0.35, 1.2 pad 2)
  Top 0.4: U$10.15 16.94,52.76 v16.25,52.76 | C15.1 10.22,56.77 7.67,56.77 v7.4,56.5
  Bottom 0.4: v16.25,52.76 10.54,52.76 7.4,55.9 v7.4,56.5
  pour Top (no thermals): 11.6,52.8 11.6,58.2 5,58.2 5,52.8
90  (via drill 0.35, 0.35 pad 0.7)
  Top 0.4: U$59.15 13.48,74.75 v13.33,74.9 | v11,75.5 R66.2 | R67.2 10.4,64.25 | 10.4,64.25 R65.1 | 10.4,64.25 v10.4,70
  Bottom 0.4: v13.33,74.9 11.7,74.9 | 11.7,74.9 11.6,74.9 v11,75.5 | 11.7,74.9 11.9,74.7 10.4,73.2 v10.4,70
A  (via drill 0.35)
  Top 0.4: OPA.P$1 47,78.45 42.3,78.45 INVERT.P$2 40.6,78.25 | U$59.18 16.18,73.61 16.08,73.51 16.08,73.12 v15.75,72.78 | R37.2 50.65,71.25 v50.7,71.3 | R39.2 40.05,71.3 v38.6,71.3 38.6,76.6 | v23.6,74.7 26,77.1 38.1,77.1 38.6,76.6 | R32.1 40.6,85.75 40.6,78.25 | 38.6,76.6 38.95,76.6 40.6,78.25
  Bottom 0.4: v15.75,72.78 16.07,73.11 16.07,73.8 16.97,74.7 v23.6,74.7 | v50.7,71.3 v38.6,71.3
BUS+  (via drill 0.35, 1.5)
  Top 0.3: 22.36,47.08 22.04,47.41 22.04,48.77 22.3,49.03
  Top 0.4: U$10.6 22.36,47.08 | 22.3,49.03 U$10.9 23.64,49.03 23.99,49.38 v24.13,49.38 | v16,50 13.97,50 C17.1 | C16.1 11.48,48.35 v2.8,48.35
  Bottom 0.4: v24.13,49.38 23.08,49.38 21.46,51 17,51 v16,50
  pour Top (no thermals): 18,46.8 18,45.7 12.4,45.7 12.4,48 4.8,48 4.8,48.7 12.4,48.7 12.4,50.5 18,50.5 18,49.4 15.3,49.4 15.3,46.8
FB1  (via drill 0.35)
  Top 0.4: C28.1 R29.2 77.71,18 v79,18 | U$5.3 72.91,36.11 73.41,35.62 v75.5,35.62 75.74,35.86 R26.1
  Bottom 0.4: v75.5,35.62 75.5,21.5 v79,18
FB2  (via drill 0.35)
  Top 0.4: U$5.12 67.1,36.75 67.1,36.05 66.5,35.46 v64.25,35.46 63.56,35.46 R25.1 | v61,18 61.16,18.16 R27.2 C27.1
  Bottom 0.4: v64.25,35.46 64.25,21.25 v61,18
GND  (via drill 0.35, 0.35 pad 0.7, 1.2 pad 2, 1.5)
  Top 0.4: C16.2 14.62,42.41 v14.62,41.78 | C16.2 13.78,41.77 v13.7,41.77 | C16.2 12.8,42.27 v12.8,41.78 | C17.2 12.92,53.85 v12.92,54.51 | C17.2 13.79,54.48 v13.82,54.51 | C17.2 14.72,53.91 v14.72,54.49 | C15.2 13.7,57.45 v14.7,57.45 | C15.2 14.27,56.93 v14.7,56.5 | C15.2 13.81,56.3 v16.4,56.3 | C6.2 14.03,40.7 v14.7,40.7 | C6.2 14.67,39.83 v14.7,39.8 | C6.2 13.8,39.83 v14.7,38.93 | R2.1 24.61,57.55 v23.6,57.55 | R31.1 24.25,38.8 v23.5,38.8 | C3.2 46.4,27.7 v46.38,27.72 | U$10.10 21.57,49.69 U$10.P$15 | C35.1 v27.9,48.02 C37.1 | C21.1 56.12,45.65 | 56.12,45.65 R20.2 | JP7.3 55.81,45.65 56.12,45.65 | R23.2 71.85,48.83 JP9.3 | JP10.3 77.85,51.61 C24.1 R24.2 | R18.2 v62,48 | C18.1 53.1,33.56 v53.1,32.9 | v78.1,41.05 78,41.15 C19.1 | U$5.10 68.38,35.38 U$5.P$15 | U$59.14 13.88,80.66 12.51,80.66 9.67,83.5 6.47,83.5 5.5,84.47 5.5,86.85 | C45.2 5.4,68 v3.8,68 | C53.2 84.2,83.4 | 84.2,83.4 85.7,83.4 v85.8,83.5 | U$59.4 20.73,78.95 U$59.P$10 | U$59.25 20.73,76.1 U$59.P$1 22.68,75.6 U$59.28 | U$23.25 68.78,75.4 U$23.P$1 66.83,75.9 U$23.28 | U$23.4 68.78,72.55 U$23.P$10 | C56.2 79.95,74.15 C57.2 83.25,73.1 R33.1 v83.65,71.8 83.65,70.5 C52.2 | U$23.9 72.03,72.75 U$23.P$7 | U$23.20 72.03,75.2 U$23.P$4 | OPA.P$2 47.4,76.9 46.8,76.9 45.6,75.7 42.1,75.7 INVERT.P$3 41.4,76.6 v40.8,76.6 | U$59.9 17.48,78.75 U$59.P$7 | U$59.20 17.48,76.3 U$59.P$4 | 6,79.5 6,78.15 R100.1 7.2,76.65 C46.2 | 6,79.5 C44.2 | 6,79.5 6.2,79.3 v6.8,79.3 | R67.1 7,64.65 7,65 | R41.2 44.7,67.75 | 44.7,67.75 R34.1 | 44.7,67.75 44.8,67.65 v44.8,66.8 | R28.1 83.75,83.85 84.2,83.4
  Top 0.5: R68.1 8.5,66.5 7,65 2,65 2,86.5 2.35,86.85 5.5,86.85 R70.2
  Bottom 0.4: 5.1,38.93 4.3,39.73
  other vias: 2.98,53.28 3.1,43.5 45.88,52.22 2.43,30.41 3.56,30.43 2.41,29.28 3.54,29.29 2.17,26.72 3.09,26.72 2.16,25.79 3.07,25.78 2.14,24.84 3.08,24.82 10.17,24.72 11.17,24.72 12.17,24.72 13.17,24.72 14.17,24.72 15.17,24.72 11.17,23.72 12.17,23.72 13.17,23.72 14.17,23.72 15.17,23.72 12.17,22.72 13.17,22.72 14.17,22.72 12.17,21.72 13.17,21.72 14.17,21.72 11.39,18.62 14.38,18.64 74.71,52.12 62.09,31.8 78.95,31.28 43.28,63.58 63.28,87.48 46.38,82.88
  pour Top (no thermals): 12.1,52.4 12.1,58.2 21.4,58.2 21.4,38.1 12.1,38.1 12.1,43.9 15.7,43.9 15.7,42.9 19,42.9 19,53.4 15.7,53.4 15.7,52.4
  pour Bottom (rank 2, no thermals): 0,91 0,15 91,15 91,91
  pour Top (no thermals): 41.5,51.2 44,51.2 44,49.6 42.4,48 42.4,45.6 37.9,45.6 37.9,42.8 46,42.8 46,40 47.8,40 49.1,41.3 49.1,45.1 47.2,45.1 46.8,44.7 46.8,43.7 44.4,43.7 43.7,44.4 43.7,45.8 47.5,49.6 47.5,53.8 33.6,53.8 30.8,51 30.8,31.1 34.5,31.1 34.5,43.8 32.5,45.8 32.5,48.6 34.3,48.6 34.3,51.3 34.6,51.6 41.1,51.6
  pour Top (no thermals): 8.86,25.3 8.86,16.6 17.7,16.6 17.7,25.3
  pour Top (no thermals): 7.18,25.57 7.18,22.94 1.77,22.94 1.77,31.09 5.79,31.09 5.79,27.59 3.65,27.59 3.65,25.57
  pour Top (no thermals): 65.76,25.89 53.89,25.89 54,29 60,29 59.96,35.19 86.06,35.19 86.06,25.89 74.26,25.89 74.26,29.49 75.26,29.49 75.26,32.79 64.76,32.79 64.76,29.49 65.76,29.49
  pour Top (no thermals): 17.7,75.49 17.7,72.41 17.05,71.76 14.91,71.76 14.91,67 11,67 11,71 12.79,72.79 16.79,72.79 17.28,73.28 17.28,75.49
  pour Top (no thermals): 7,69.26 2.5,69.26 2.5,66 7,66
  pour Top (no thermals): 17.63,79.5 17.63,82.87 17.13,83.37 15.15,83.37 15.15,88 11,88 11,84 12.49,82.51 16.67,82.51 17.32,81.86 17.32,79.5
  pour Top (no thermals): 14.4,79.19 14.4,81 13.5,81 13.5,75.84 23.5,75.84 23.5,79.19
  pour Top (no thermals): 71.88,76.02 71.88,78.91 72.75,79.78 74.62,79.78 74.62,84.51 78.53,84.51 78.53,80.51 76.74,78.72 72.74,78.72 72.25,78.23 72.25,76.02
  pour Top (no thermals): 82.53,82.27 87.03,82.27 87.03,85.51 82.53,85.51
  pour Top (no thermals): 71.86,72.01 71.86,68.64 72.36,68.14 74.53,68.14 74.53,63.51 78.53,63.51 78.53,67.51 77.06,68.98 72.88,68.98 72.21,69.65 72.21,72.01
  pour Top (no thermals): 75,72.31 75,70.5 76,70.5 76,75.66 66,75.66 66,72.31
INA_BMS+  (via drill 0.35, 0.35 pad 0.7, 1.5)
  Top 0.4: U$23.19 72.68,78.27 v72.89,78.48 | R72.2 10.55,88.4 v15.1,88.4
  Bottom 0.4: v72.89,78.48 71.1,80.27 v71.1,81.2 | v15.1,88.4 17,88.4 18.48,86.92 v18.48,84.73
  Bottom 1: v70,81.2 70,86.8 67.42,89.38 | 67.42,89.38 67.48,89.38 v66.78,88.68 | 67.42,89.38 22.9,89.38 19.52,86 v19.52,84.71
  pour Top (no thermals): 19.61,79.58 18.77,79.58 18.77,83.67 16.91,85.53 16.91,86.93 20.86,86.93 20.86,85.36 19.61,84.11
  pour Top (no thermals): 69.9,76.11 69.9,80.64 68.73,81.81 68.73,83.41 72.43,83.41 72.43,81.77 70.75,80.09 70.75,76.11
  pour Bottom (no thermals): 16.9,86.9 16.9,84.1 20.9,84.1 20.9,87 16.9,87
  pour Bottom (no thermals): 68.4,83.5 68.4,80.6 72.4,80.6 72.4,83.5
INA_BUS+  (via drill 0.35, 0.35 pad 0.7, 0.5, 1.5)
  Top 0.4: v74.3,62.8 80.76,62.8 U$25.P$3 | v14.8,66.3 14.8,65.75 R65.2 | U$59.19 16.83,73.1 v16.93,73
  Top 0.8: R40.1 v40.1,66.4
  Bottom 0.4: v71.4,66.8 74.3,63.9 v74.3,62.8 | v14.8,66.3 18.2,69.7 v18.2,70.3 16.93,71.57 v16.93,73
  Bottom 0.8: v40.1,66.4 40.1,62.4 40.1,61.8 40.2,61.7
  Bottom 1: v70,66.8 70,64.8 66.9,61.7 40.2,61.7 24.3,61.7 19.6,66.4 v19.6,70.3 | v40.08,62.48 40.1,62.45 40.1,62.4
  pour Top (no thermals): 19.62,75.4 19.62,70.88 20.8,69.7 20.8,68.1 17.1,68.1 17.1,69.8 18.78,71.48 18.78,75.4
  pour Top (no thermals): 69.92,71.9 70.75,71.9 70.75,67.93 72.6,66.08 72.6,64.64 68.77,64.64 68.77,66.25 69.92,67.4
  pour Bottom (no thermals): 17.1,68.1 20.8,68.1 20.8,70.8 17.1,70.8
  pour Bottom (no thermals): 68.9,64.6 72.6,64.6 72.6,67.3 68.9,67.3
INTVCC  (via drill 0.35)
  Top 0.4: U$5.22 70.33,31.21 70.33,28.75 v70.58,28.51 | v78,37 78.51,37.51 R21.2 | R21.2 C22.2 C23.2 R22.2 | R22.2 R21.2 | JP10.1 86.93,47.61 86.93,45.11 85.54,43.72 JP6.3 84.58,41.04 84.58,39.15 JP1.2 83.34,38 82.85,37.51 R22.2
  Bottom 0.4: v78,37 75.56,37 74.63,36.07 74.63,32.56 74.07,32 70.3,32 70.3,30.72 | JP4.3 57.81,37.75 59.01,38.95 59.01,41.55 JP5.3 62.46,39.86 66.17,36.15 66.17,31.96 66.8,31.34 69.68,31.34 70.3,30.72 | v70.58,28.51 70.36,28.73 70.36,30.66 70.3,30.72
N$1
  Top 0.4: U$10.8 24.47,48.38 25.18,49.1 25.18,53.03 23.41,54.8 R1.1
N$2
  Top 0.4: R31.2 25.8,42.05 25.8,44.35 LED1.C
N$3  (via drill 0.35)
  Top 0.4: U$10.11 22.97,50.34 23.66,50.34 24.32,51.01 v24.32,51.09 | v26.4,50.9 26,51.3 LED2.A
  Bottom 0.4: v24.32,51.09 24.48,50.93 26.37,50.93 v26.4,50.9
N$4
  Top 0.4: LED2.C 25.3,54.15 R2.2
N$5
  Top 0.4: C2.2 37.35,46.9 U$1.P$8
N$6
  pour Top (no thermals): 39.6,42.4 39.6,39 42.2,36.4 42.2,31.43 41.3,31.4 41.3,25.2 35.1,25.2 35.1,44.5 37.4,44.5 37.4,42.4
N$7
  Top 0.4: U$1.P$6 41.63,47.88 43.3,49.55 R3.2
N$8
  Top 0.4: R5.2 46.6,38.95 45.15,40.4 R4.1 43.2,41.2 U$1.P$4
N$9  (via drill 0.35)
  Top 0.4: U$1.P$2 40.37,40.13 v40.5,40 | v37.2,47.8 35.95,47.8 R6.1 R7.1
  Bottom 0.4: v40.5,40 37.2,43.3 v37.2,47.8
N$10  (via drill 1.5)
  other vias: 38.48,50.02
  pour Top (no thermals): 39.7,46 41,46 41,47.9 42,48.9 42,50.8 41.33,50.8 40.93,51.2 34.8,51.2 34.8,48.7 38.4,48.7 38.9,48.2 39.7,48.2
N$11
  Top 0.4: C36.1 R10.1
N$12  (via drill 0.35)
  Top 0.4: C36.2 45.15,44.8 v44.3,44.8 | v42.1,40 41.63,40.47 U$1.P$3
  Bottom 0.4: v44.3,44.8 44.3,42.2 v42.1,40
N$13
  pour Top (no thermals): 8.67,26.75 8.67,29.03 10.68,31.04 12.76,31.04 12.77,31.03 12.77,29.03 11.24,29.03 9.45,27.24 9.45,26.75
N$14
  pour Top (no thermals): 8.19,24 8.19,26.37 10.66,26.37 13.17,28.88 13.17,31 25,31 25,25.69 8.49,25.69 8.49,24
N$15  (via drill 0.35)
  Top 0.4: U$3.P$6 8.32,28.24 v7.95,28.61 | v6.19,19.97 5.18,19.97 R11.2
  Bottom 0.4: v7.95,28.61 6.19,26.85 v6.19,19.97
N$16
  Top 0.4: C8.2 4.55,26.1 7.68,26.1 7.68,27.41 U$3.P$7
N$17  (via drill 1.5)
  other vias: 3.55,18.18
  pour Top (rank 2, no thermals): 7.52,25.52 7.79,25.52 8.48,23.05 8.48,16.6 1.79,16.6 1.79,22.59 7.29,22.59 7.52,22.82
N$18
  pour Top (no thermals): 7.34,26.57 6.16,26.57 6.16,31.47 2.71,31.47 2.71,32.82 8.03,32.82 8.03,29.2 7.34,29.2
N$19  (via drill 0.35, 1.5)
  Top 0.4: R15.2 10.85,33.85 v11,34 | v21.49,22.14 20.68,21.33 C12.2
  Bottom 0.4: v11,34 21,34 25.51,29.49 25.51,23.51 24.14,22.14 v21.49,22.14
  other vias: 22.99,19.66
  pour Top (no thermals): 18.09,25.28 25,25.28 25,16.57 18.09,16.57
  pour Top (no thermals): 2.73,33.2 2.73,34.65 11.65,34.65 11.66,34.64 11.66,33.2
N$20  (via drill 0.35)
  Top 0.4: U$5.7 70.34,36.79 70.34,38.76 70.22,38.88 v70.12,38.88 | JP1.1 JP2.1 JP3.1
  Bottom 0.4: v70.12,38.88 70.43,38.88 71.37,39.82 82.79,39.82 83.2,40.23 86.04,40.23 JP1.1
N$21
  Top 0.4: JP4.1 JP4.2 55,31.17 R17.2 58.76,37.91 62.92,37.91 64.05,36.77 U$5.14
N$22
  Top 0.4: R17.1 54.98,35.87 C18.2
N$23
  Top 0.4: R16.1 84.38,34 JP2.2
N$24  (via drill 0.35)
  Top 0.3: 22.32,46.44 21.99,46.1 21.99,44.19 22.34,43.83
  Top 0.4: U$10.21 U$10.22 17.11,48.04 v16.21,48.04 | C14.2 22.96,41.98 U$10.1 22.34,43.83 | U$10.7 24.07,47.73 v24.4,47.4 24.4,47.2 23.64,46.44 U$10.5 22.32,46.44 | U$10.14 23.09,52.41 v23.09,53.51
  Bottom 0.4: v16.21,48.04 16.21,47.79 18.8,45.2 22.2,45.2 v24.4,47.4 25.2,48.2 25.2,49.93 24.89,50.24 23.49,50.24 23,50.73 23,53.42 v23.09,53.51
N$25  (via drill 0.35)
  Top 0.4: U$10.3 24.43,45.13 v24.48,45.08 24.84,44.72 24.84,42.75 23.34,41.25 23.34,40.04 R8.1 | v3.9,38.6 3.9,39.85 R13.1
  Bottom 0.4: v24.48,45.08 17.44,38.04 4.46,38.04 v3.9,38.6
N$26
  Top 0.4: R18.1 65,47.85 JP5.2 JP5.1 69.25,43.3 69.25,38.28 69.67,37.85 U$5.8
N$27  (via drill 0.35)
  Top 0.4: U$5.21 69.67,28.83 v69.43,28.59 | v62,37 61.02,36.02 C20.2
  Bottom 0.4: v69.43,28.59 69.73,28.89 69.73,30.07 69.12,30.68 66.52,30.68 65.42,31.79 65.42,35.68 64.1,37 v62,37
N$28
  pour Top (no thermals): 18,44.3 5.8,44.3 5.8,47.6 12,47.6 12,45.3 18,45.3
N$29
  Top 0.4: JP6.2 JP6.1 78.57,40.11 74.23,40.11 | 74.23,40.11 U$5.1 | R19.2 74.23,40.92 74.23,40.11
N$30
  Top 0.4: R19.1 C19.2
N$31  (via drill 0.35)
  Top 0.4: v3.77,46.46 4.33,47.02 C5.2 | v15.78,47.01 15.87,47.1 17.4,47.1 U$10.23
  Bottom 0.4: v3.77,46.46 4.32,47.01 v15.78,47.01
N$32  (via drill 0.35)
  Top 0.4: v15.11,48.29 15.86,49.04 U$10.20 | v3.66,50.34 4.33,50.34 C1.1
  Bottom 0.4: v15.11,48.29 5.71,48.29 v3.66,50.34
N$33
  pour Top (no thermals): 18,52 5.9,52 5.9,49.1 12,49.1 12,50.9 18,50.9
N$34
  pour Top (no thermals): 66.2,31.82 66.2,19.72 69.04,19.72 69.04,25.82 67.24,25.82 67.24,31.82
N$35
  pour Top (no thermals): 73.75,31.84 73.75,19.64 70.51,19.64 70.51,25.84 72.8,25.84 72.8,31.84
N$36  (via drill 0.35)
  Top 0.4: U$5.4 72.28,37.8 v72.52,38.04 | v83.65,39.32 83.54,39.21 R22.1
  Bottom 0.4: v72.52,38.04 82.37,38.04 v83.65,39.32
N$37
  Top 0.4: U$5.13 66.45,36.8 66.45,37.43 65.13,38.75 56.5,38.75 55.32,39.93 JP8.2
N$38
  Top 0.4: JP7.2 55,48.51 R20.1 62.51,41 67.32,41 68.55,39.77 68.55,37.94 69.03,37.45 U$5.9
N$39  (via drill 0.35)
  Top 0.3: v21.7,55.97 21.7,56.43 R9.1
  Top 0.4: v4.1,57.7 3.9,57.5 3.9,56.35 R12.1 | U$10.12 22.26,50.98 22,51.25 v22,53.2
  Bottom 0.3: v22,53.2 22,55.66 v21.7,55.97
  Bottom 0.4: v22,53.2 21.56,53.64 11.86,53.64 8.88,56.62 8.88,58 4.4,58 v4.1,57.7
N$40  (via drill 0.35)
  Top 0.4: U$5.11 67.72,37.93 v67.67,37.98 | v78.04,38.9 79.22,38.9 R21.1
  Bottom 0.4: v67.67,37.98 69.46,37.98 69.74,37.7 70.54,37.7 71.81,38.97 77.97,38.97 v78.04,38.9
N$41
  Top 0.4: JP9.2 70.15,49.35 R23.1 70.97,45.17 U$5.6
N$42  (via drill 0.35)
  Top 0.4: U$5.2 73.58,39.79 v72.63,40.74
  Bottom 0.4: v72.63,40.74 73.74,40.74 JP11.2
N$43
  Top 0.4: JP8.1 57.78,43.22 C21.2
N$44
  Top 0.4: JP10.2 81.85,50.15 R24.1 80.13,47.28 78.55,47.28 77.82,46.55 77.82,44.97 76.67,43.82 73.25,43.82 73.02,43.59 73.02,42.36 71.62,40.97 U$5.5
N$45
  Top 0.4: JP11.1 76.15,46.31 C24.2
N$46  (via drill 0.35)
  Top 0.4: C25.2 67.69,18.69 v67,18 | v68.8,29.62 68.8,30.33 69.03,30.55 U$5.20
  Bottom 0.4: v67,18 68.39,19.39 68.39,29.21 v68.8,29.62
N$47
  Top 0.4: U$10.4 23.86,45.78 24.03,45.95 LED1.A
N$48  (via drill 0.35)
  Top 0.4: C26.2 72.36,18.64 v73,18 | v71.23,29.69 71.23,30.2 70.97,30.45 U$5.23
  Bottom 0.4: v73,18 71.43,19.57 71.43,29.49 v71.23,29.69
N$49
  Top 0.4: JP13.1 52.7,43.76 JP8.3
N$50
  Top 0.4: JP11.3 85.44,46 JP12.1
N$51  (via drill 0.35)
  Top 0.4: U$10.2 22.99,44.51 23.62,44.51 23.93,44.2 23.93,43.13 v23.9,43.1 | C35.2 v27.91,43.84
  Bottom 0.4: v23.9,43.1 23.92,43.12 27.19,43.12 v27.91,43.84
N$52  (via drill 0.35)
  Top 0.4: U$10.13 23.67,51.63 24.14,52.11 v24.14,52.79 | v27.89,52.19 C37.2
  Bottom 0.3: v27.89,52.19 27.29,52.79 v24.14,52.79
N$53
  Top 0.8: U$14.P$1 JP14.1
N$54
  Top 0.8: U$15.P$1 JP15.1
N$55
  Top 0.8: U$16.P$1 JP16.1
N$56
  Top 0.8: U$14.P$2 JP17.1
N$57
  Top 0.8: U$15.P$2 JP18.1
N$58
  Top 0.8: U$16.P$2 JP19.1
N$59
  Top 0.8: U$17.P$1 JP20.1
N$60
  Top 0.8: U$18.P$1 JP21.1
N$61
  Top 0.8: U$19.P$1 JP22.1
N$62
  Top 0.8: U$17.P$2 JP23.1
N$63
  Top 0.8: U$18.P$2 JP24.1
N$64
  Top 0.8: U$19.P$2 JP25.1
N$65
  Top 0.8: U$20.P$1 JP26.1
N$66
  Top 0.8: U$21.P$1 JP27.1
N$67
  Top 0.8: U$22.P$1 JP28.1
N$68
  Top 0.8: U$20.P$2 JP29.1
N$69
  Top 0.8: U$21.P$2 JP30.1
N$70
  Top 0.8: U$22.P$2 JP31.1
N$71
  Top 0.8: U$8.P$1 JP32.1
N$72
  Top 0.8: U$9.P$1 JP33.1
N$73
  Top 0.8: U$13.P$1 JP34.1
N$74
  Top 0.8: JP35.1 U$8.P$2
N$75
  Top 0.8: U$9.P$2 JP36.1
N$76
  Top 0.8: U$13.P$2 JP37.1
N$77
  pour Top (no thermals): 71.13,79.94 71.13,76.21 71.49,76.21 71.49,79.05 72.61,80.17 74.19,80.17 74.22,80.2 74.22,84.82 73.53,85.51 53.03,85.51 53.03,74.51 62.03,74.51 62.03,83.01 67.73,83.01 67.73,78.51 69.03,78.51 69.03,76.11 69.52,76.11 69.52,80.47 68.35,80.47 68.35,83.79 72.82,83.79 72.82,81.63
N$78
  pour Top (no thermals): 62.03,73.51 53.03,73.51 53.03,62.51 73.03,62.51 74.03,63.51 74.03,67.51 73.8,67.74 72.23,67.74 71.48,68.49 71.48,71.89 71.13,71.89 71.13,68.09 72.99,66.23 72.99,64.22 68.35,64.22 68.35,67.55 69.53,67.55 69.53,71.89 69.03,71.89 69.03,69.51 67.26,69.51 67.26,65.01 62.03,65.01
N$79
  Top 0.4: U$23.17 73.98,77.47 75.01,78.5 77.35,78.5 R28.2
N$80
  Top 0.4: C49.2 67,77.88 67.12,77.76 67.98,77.76 68.13,77.61 U$23.26
N$81
  Top 0.4: U$23.13 74.63,70.5 74.88,70.25 80.9,70.25 R30.1
N$82
  Top 0.4: R30.2 C52.1
N$84
  Top 0.4: C50.2 66.5,69.57 67.18,70.25 67.89,70.25 68.13,70.49 U$23.3
N$85
  Top 0.4: LED_R1.A R32.2
N$86
  Top 0.4: U$23.12 73.98,70.27 74.95,69.3 77.5,69.3 79.7,67.1 82.4,67.1 U$25.P$2
N$87
  Top 0.4: R57.2 LED_R2.A
N$89
  Top 0.4: U$59.12 15.53,81.26 14.43,82.36 11.69,82.36 9,85.05 R72.1
  Top 0.5: R72.1 R70.1
N$90
  Top 0.4: R39.1 R38.1 44.4,72.95 OPA.P$3
N$91
  Top 0.4: LED_G1.C 4.15,75.6 R100.2
N$92
  Top 0.4: LED_G2.C 85.35,75.9 R33.2
N$129
  Top 0.4: C41.2 23,81.92 22.34,81.26 21.58,81.26 21.38,81.06 U$59.3
N$131
  pour Top (no thermals): 18.4,71.65 18.4,75.4 18.08,75.4 18.08,72.23 17.22,71.37 15.37,71.37 15.31,71.31 15.31,66.69 16,66 36.5,66 36.5,77 27.5,77 27.5,68.5 22.22,68.5 22.22,73 20.5,73 20.5,75.4 20.01,75.4 20.01,71.06 21.19,71.06 21.19,67.71 16.72,67.71 16.72,69.97
N$132
  pour Top (no thermals): 27.5,78.07 36.5,78.07 36.5,89.07 16.5,89.07 15.53,88.1 15.53,84.04 15.74,83.83 17.27,83.83 18.01,83.09 18.01,79.62 18.37,79.62 18.37,83.52 16.52,85.37 16.52,87.4 21.25,87.4 21.25,83.93 20,83.93 20,79.57 20.5,79.57 20.5,82.07 22.27,82.07 22.27,86.57 27.5,86.57
N$135  (via drill 0.35)
  Top 0.4: U$59.13 14.88,81.02 14.51,81.39 14.02,81.39 13.9,81.51 v13.02,81.51 | v11.45,80.51 8.64,80.51 R69.1
  Bottom 0.4: v13.02,81.51 12.38,81.51 11.45,80.58 v11.45,80.51
N$136
  Top 0.4: C44.1 R69.2
N$139
  Top 0.4: C46.1 R66.1
N$142
  Top 0.4: U$59.17 15.53,73.81 14.8,73.08 12.23,73.08 R68.2
N$144
  Top 0.4: C40.2 23,73.13 22.38,73.75 21.62,73.75 21.38,73.99 U$59.26
N$215  (via drill 0.35 pad 0.7)
  Top 0.4: U$23.11 73.33,70 73.55,69.78 73.55,69.49 v73.9,69.14 | v76.5,73.1 76.5,75.9 | 76.5,75.9 78.45,75.9 C56.1 78.55,75.9 C57.1 81.1,76 LED_G2.A | 76.5,75.9 75.65,76.75 U$23.15
  Bottom 0.4: v73.9,69.14 76.5,71.74 v76.5,73.1
  pour Top (no thermals): 74.28,76.11 74.28,78.15 80.17,78.15 82.53,80.51 82.53,81.85 85.53,81.85 85.53,78.51 84.53,77.51 75.42,77.51 75.42,76.11
N$234  (via drill 0.35 pad 0.7)
  Top 0.4: U$59.11 16.18,81.2 16.16,81.22 16.16,81.55 15.72,81.99 v15.72,82.3 | v12.8,79.77 12.4,79.37 12.4,74.6 13.2,73.8 14.64,73.8 14.88,74.04 U$59.16 | C45.1 5.75,71.15 LED_G1.A
  Bottom 0.4: v15.72,82.3 15.33,82.3 v12.8,79.77
  pour Top (no thermals): 15.25,75.4 15.25,73.36 9.36,73.36 7,71 7,69.66 4,69.66 4,73 5,74 14.61,74 14.61,75.4
N$302
  Top 0.4: R36.1 R37.1 50.1,73.85 OPA.P$4
PGOOD1  (via drill 0.35)
  Top 0.4: U$59.10 16.83,82.08 v16.79,82.13 | v23.6,81.1 26.9,77.8 36.6,77.8 38.4,79.6 LED_R1.C
  Bottom 0.4: v16.79,82.13 17.71,81.2 23.5,81.2 v23.6,81.1
PGOOD2  (via drill 0.35, 0.35 pad 0.7)
  Top 0.4: U$23.10 72.68,69.29 v72.74,69.23 | v62.7,74.7 62.4,74.4 53.4,74.4 52.95,74.85 52.95,77.13 52.1,77.98 52.1,85.85 LED_R2.C
  Bottom 0.4: v72.74,69.23 67.07,69.23 62.7,73.6 v62.7,74.7
RUN
  Top 0.4: R38.2 R41.1 R40.2
VDD  (via drill 0.35, 1.2 pad 2)
  Top 0.4: U$10.28 16.88,43.3 v16.3,43.3 | v7.7,41.1 9.09,41.1 C6.1
  Bottom 0.4: v7.7,41.1 11,41.1 11,43.8 11.3,44.1 15.5,44.1 v16.3,43.3
  pour Top (no thermals): 11.5,38.1 11.5,43.9 4.9,43.9 4.9,38.1
VIN  (via drill 0.35, 1.2 pad 2)
  Top 0.4: JP7.1 61,49 | 61,49.51 JP9.1 | 61,49 v61,47 | v56,29 55,29 54,28 54,18 55,17 68.48,17 69.39,17.91 69.39,18.39 70,19 | v60.9,49.7 61,49.6 61,49.51 | 61,49.51 61,49
  Bottom 0.4: v61,47 61,45.7 56.51,41.21 56.51,29.51 v56,29
  pour Top (no thermals): 71.32,31.82 72.42,31.82 72.42,26.22 70.12,26.22 70.12,18.62 69.42,18.62 69.42,26.22 67.62,26.22 67.62,31.82 68.72,31.82 68.72,29.12 71.32,29.12
VON1  (via drill 0.35, 1.2 pad 2)
  Top 0.4: U$5.28 74.22,30.4 v74.63,30
  Bottom 0.4: v82.9,20.7 82.9,20.57 79.4,17.07 78.7,17.07 74.63,21.14 v74.63,30
  pour Top (no thermals): 86.06,25.5 74.13,25.5 74.13,18.9 86.06,18.9
VON2  (via drill 0.35, 1.2 pad 2)
  Top 0.4: U$5.15 65.78,30.35 v65.42,30
  Bottom 0.4: v56.9,20.7 56.97,20.7 60.6,17.07 61.3,17.07 65.42,21.19 v65.42,30
  pour Top (no thermals): 65.82,25.48 53.97,25.48 53.97,18.88 65.82,18.88
Y  (via drill 0.35, 0.35 pad 0.7)
  Top 0.4: U$23.18 73.33,77.7 73.95,78.32 v73.95,78.64 | v66,77.7 66,76.7 62.9,73.6 53,73.6 v52.5,74.1 52.3,74.3 52.3,76.8 51.35,77.75 51.35,83.8 R57.1 | v46,77.45 45.86,77.3 INVERT.P$4
  Bottom 0.4: v73.95,78.64 73.95,78.26 73.43,77.74 73.43,77.6 73,77.17 72.4,77.17 71.87,77.7 v66,77.7 | v52.5,74.1 49.35,74.1 v46,77.45

### Text on the board
tNames: BMS+ | GND | GND | 3V3 | GND | BUS+ | 5V | GND | GND | IN | GND | GND | IN | IN | GND | 3V3 | GND | GND | GND | GND | 5V | 3V3 | IN | OUT | OUT
bNames: LTC3119 | LTC3633 | MP1584 | MP2225 | LTC3633 / on board